# EAGLE board ELOB_V1722_Index_B (EAGLE 6.5.0), part 1 of 2
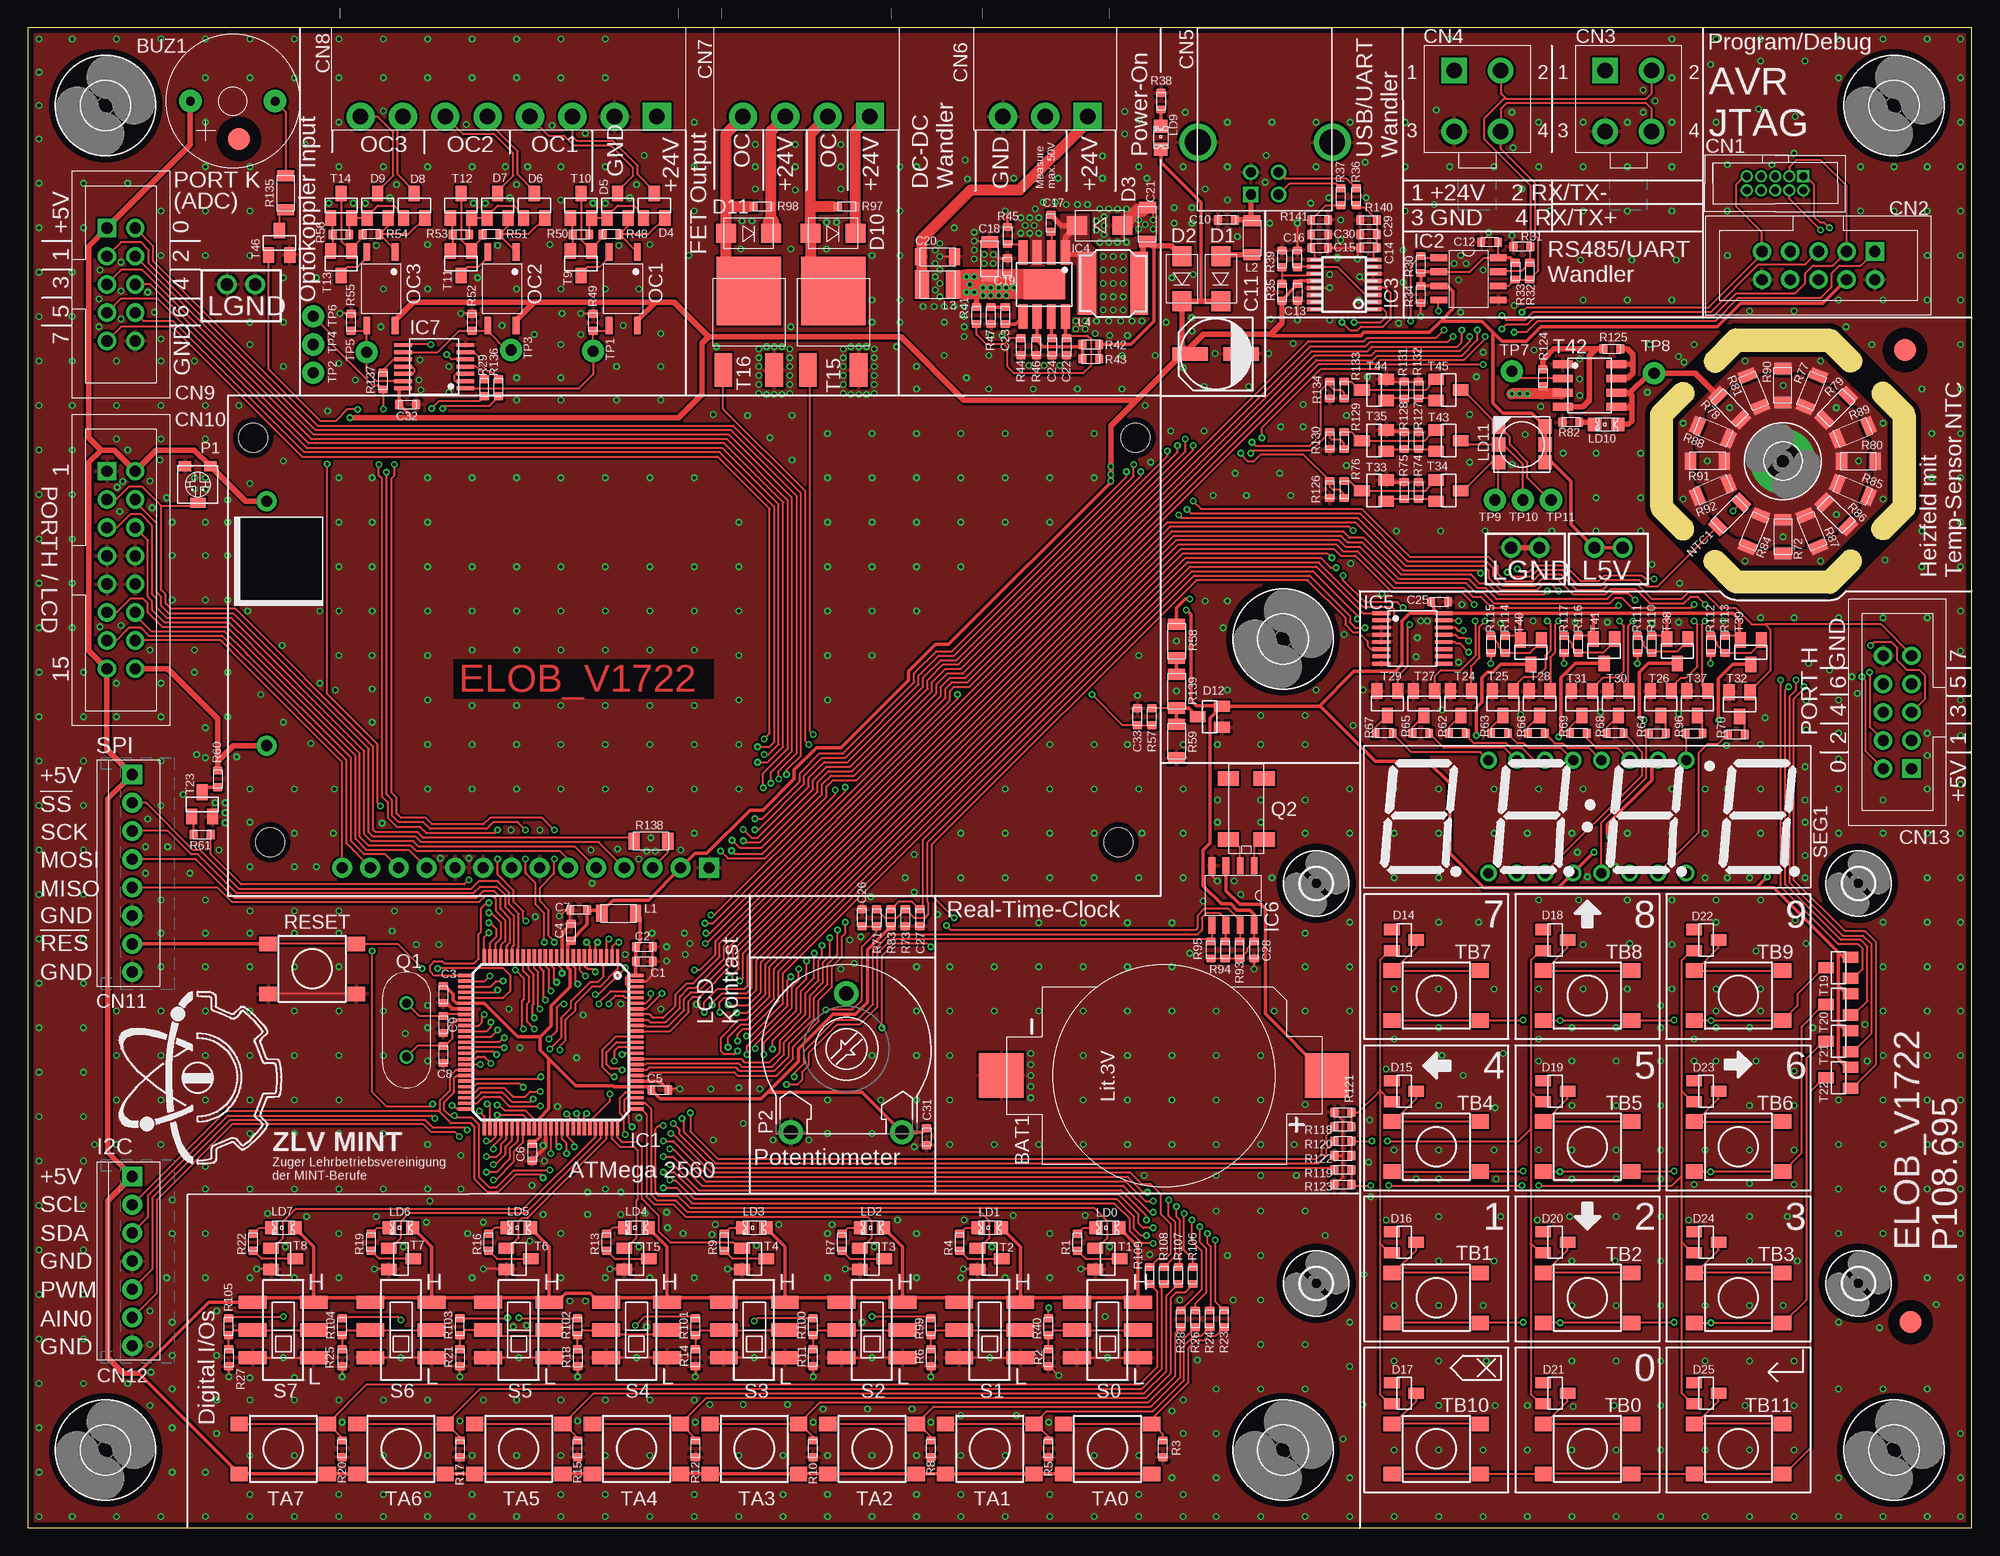
[diagram p8: board, top side]
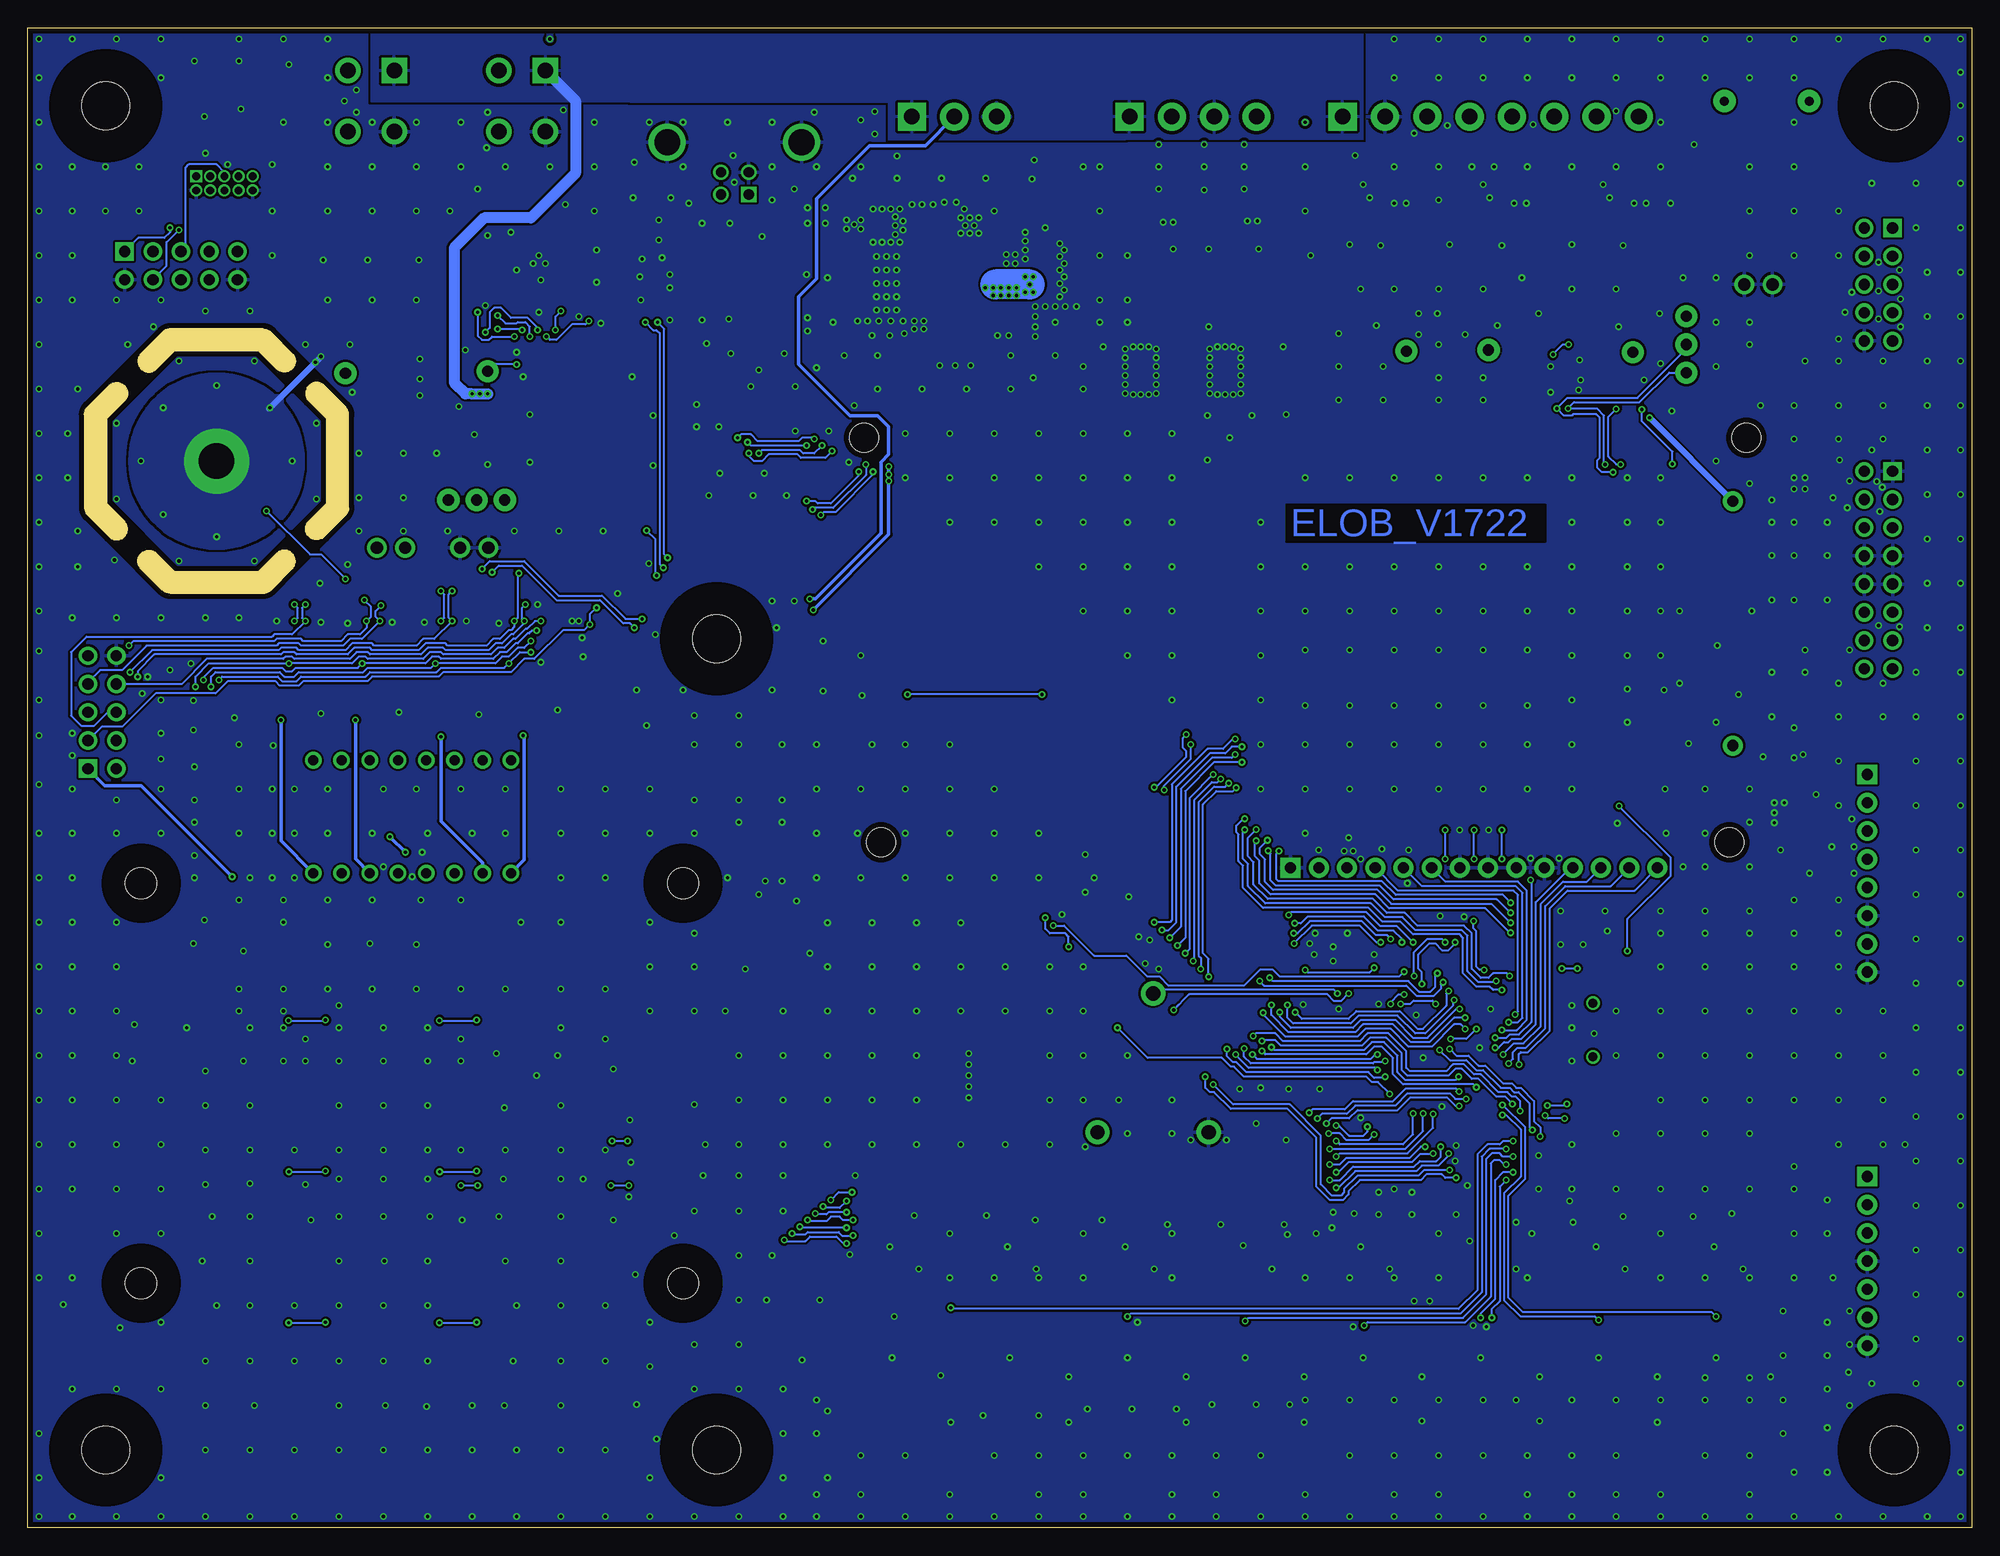
[diagram p9: board, bottom side, seen from below]

Size 175 x 135 mm. Coordinates in mm from the lower left corner, seen from the top.
Outline: 0,0 175,0 175,135 0,135 0,0
Outline: 162.19,84.1 arc45 162.89,84.39 164.82,86.32 arc45 165.1,87 arc45 164.82,87.68 164.78,87.72 arc45 164.1,88 arc45 163.42,87.72 161.8,86.1 154.2,86.1 152.58,87.72 arc45 151.9,88 arc45 151.22,87.72 151.18,87.68 arc45 150.9,87 arc45 151.18,86.32 153.11,84.39 arc45 153.81,84.1 162.19,84.1
Outline: 169.9,100.19 arc45 169.61,100.89 167.68,102.82 arc45 167,103.1 arc45 166.32,102.82 166.28,102.78 arc45 166,102.1 arc45 166.28,101.42 167.9,99.8 167.9,92.2 166.28,90.58 arc45 166,89.9 arc45 166.28,89.22 166.32,89.18 arc45 167,88.9 arc45 167.68,89.18 169.61,91.11 arc45 169.9,91.81 169.9,100.19
Outline: 146.1,91.81 arc45 146.39,91.11 148.32,89.18 arc45 149,88.9 arc45 149.68,89.18 149.72,89.22 arc45 150,89.9 arc45 149.72,90.58 148.1,92.2 148.1,99.8 149.72,101.42 arc45 150,102.1 arc45 149.72,102.78 149.68,102.82 arc45 149,103.1 arc45 148.32,102.82 146.39,100.89 arc45 146.1,100.19 146.1,91.81
Outline: 153.81,107.9 arc45 153.11,107.61 151.18,105.68 arc45 150.9,105 arc45 151.18,104.32 151.22,104.28 arc45 151.9,104 arc45 152.58,104.28 154.2,105.9 161.8,105.9 163.42,104.28 arc45 164.1,104 arc45 164.78,104.28 164.82,104.32 arc45 165.1,105 arc45 164.82,105.68 162.89,107.61 arc45 162.19,107.9 153.81,107.9
Copper layers (1*16): Top 0.035mm / dielectric 1.5mm / Bottom 0.035mm
Design rules "LED_0,20mm *": minimum track width 0.2mm, minimum drill 0.3mm, track to track 0.2mm, track to pad 0.2mm, pad to pad 0.2mm, via to via 0.2mm, smd to smd 0.2mm, copper to edge 0.5mm, drill to drill 0.2mm, minimum pad ring 0.15mm, minimum via ring 0.15mm, stop-mask expansion 4mil, vias tented up to drill 0.5mm, thermal gap 10mil
Net classes: 1 Power: clearance 0.5 mm; 3 PWM_OC: width 0.15 mm, drill 0.3 mm, clearance 0.8 mm to class 0, clearance 0.8 mm to class 1, clearance 0.2 mm to class 2, clearance 0.2 mm
tKeepout: 5 lines
tRestrict: 8 lines
bRestrict: 8 lines
Milling: 12 lines

## Footprints (pad centres in the part's own frame; a part is rotated, then mirrored left to right if it is on the bottom)
TESTPAD_2P_V1_NORESTRICT = drill 1.1 pad 1.778: 1 -1.27,0; 2 1.27,0
CR2032SMT_WÜRTH = smd 4 x 4: + 0,14.65; - 0,-14.65
BUZ_TCW12 = drill 0.8 pad 2.032: VCC 3.81,0; VSS -3.81,0
C0603 = smd 0.762 x 0.889: 1 -0.762,0; 2 0.762,0
ELKO_SMD_6.3 = smd 1.2 x 3.2: M 0,-2.3; P 0,2.3
C1206 = smd 1.016 x 1.524: 1 -1.524,0; 2 1.524,0
BH10G_1.27 = drill 0.7 pad 1.07 square: 1 -2.54,-0.635 | drill 0.7 pad 1.07: 2 -2.54,0.635; 3 -1.27,-0.635; 4 -1.27,0.635; 5 0,-0.635; 6 0,0.635; 7 1.27,-0.635; 8 1.27,0.635; 9 2.54,-0.635; 10 2.54,0.635
BH_10G = drill 1.016 pad 1.651 square: 1 -5.08,-1.27 | drill 1.016 pad 1.651: 2 -5.08,1.27; 3 -2.54,-1.27; 4 -2.54,1.27; 5 0,-1.27; 6 0,1.27; 7 2.54,-1.27; 8 2.54,1.27; 9 5.08,-1.27; 10 5.08,1.27
MOLEX_MINIFIT_4G = drill 1.4 pad 2.3 square: 1 2.1,-2.75 | drill 1.4 pad 2.3: 2 -2.1,-2.75; 3 2.1,2.75; 4 -2.1,2.75
USB-B = drill 0.92 square: 1 15,4.8 | drill 0.92: 2 15,7.3; 3 13,7.3; 4 13,4.8 | drill 2.33: 5 10.29,12.13; 6 10.29,0.03
PHOENIX_G381_3 = drill 1.4 pad 2.54 square: 1 -3.81,0 | drill 1.4 pad 2.54: 2 0,0; 3 3.81,0
PHOENIX_G381_4 = drill 1.4 pad 2.54 square: 1 -5.715,0 | drill 1.4 pad 2.54: 2 -1.905,0; 3 1.905,0; 4 5.715,0
PHOENIX_G381_8 = drill 1.4 pad 2.54 square: 1 -13.335,0 | drill 1.4 pad 2.54: 2 -9.525,0; 3 -5.715,0; 4 -1.905,0; 5 1.905,0; 6 5.715,0; 7 9.525,0; 8 13.335,0
BH_16G = drill 1.016 pad 1.651 square: 1 -8.89,-1.27 | drill 1.016 pad 1.651: 2 -8.89,1.27; 3 -6.35,-1.27; 4 -6.35,1.27; 5 -3.81,-1.27; 6 -3.81,1.27; 7 -1.27,-1.27; 8 -1.27,1.27; 9 1.27,-1.27; 10 1.27,1.27; 11 3.81,-1.27; 12 3.81,1.27; 13 6.35,-1.27; 14 6.35,1.27; 15 8.89,-1.27; 16 8.89,1.27
TYCO_MTA-100_8G = drill 1.016 pad 1.778 square: 1 8.89,0 | drill 1.016 pad 1.778: 2 6.35,0; 3 3.81,0; 4 1.27,0; 5 -1.27,0; 6 -3.81,0; 7 -6.35,0; 8 -8.89,0
TYCO_MTA-100_7G = drill 1.016 pad 1.778 square: 1 7.62,0 | drill 1.016 pad 1.778: 2 5.08,0; 3 2.54,0; 4 0,0; 5 -2.54,0; 6 -5.08,0; 7 -7.62,0
SMA = smd 1.8 x 1.7: A 2.03,0; C -2.03,0
SOT_23 = smd 1 x 1.4: 1 -0.95,-1.1; 2 0.95,-1.1; 3 0,1.1
DISPLAY_DMC16202NY-LY-AZE-BJN = drill 1 pad 1.8 square: 1 43.32,2.5 | drill 1 pad 1.8: 2 40.78,2.5; 3 38.24,2.5; 4 35.7,2.5; 5 33.16,2.5; 6 30.62,2.5; 7 28.08,2.5; 8 25.54,2.5; 9 23,2.5; 10 20.46,2.5; 11 17.92,2.5; 12 15.38,2.5; 13 12.84,2.5; 14 10.3,2.5; 15 3.5,13.5; 16 3.5,35.5 | hole 2.6: 3.8,4.8; 2.3,41.2; 81.7,41.2; 80.2,4.8
2,8 = hole 2.8: 0,0
4,3 = hole 4.3: 0,0
3,2-PAD = drill 3.2 pad 5.842: B3,2 0,0
TQFP100 = smd 0.3 x 1.2: 1 -6,-7.75; 2 -5.5,-7.75; 3 -5,-7.75; 4 -4.5,-7.75; 5 -4,-7.75; 6 -3.5,-7.75; 7 -3,-7.75; 8 -2.5,-7.75; 9 -2,-7.75; 10 -1.5,-7.75; 11 -1,-7.75; 12 -0.5,-7.75; 13 0,-7.75; 14 0.5,-7.75; 15 1,-7.75; 16 1.5,-7.75; 17 2,-7.75; 18 2.5,-7.75; 19 3,-7.75; 20 3.5,-7.75; 21 4,-7.75; 22 4.5,-7.75; 23 5,-7.75; 24 5.5,-7.75; 25 6,-7.75; 51 6,7.75; 52 5.5,7.75; 53 5,7.75; 54 4.5,7.75; 55 4,7.75; 56 3.5,7.75; 57 3,7.75; 58 2.5,7.75; 59 2,7.75; 60 1.5,7.75; 61 1,7.75; 62 0.5,7.75; 63 0,7.75; 64 -0.5,7.75; 65 -1,7.75; 66 -1.5,7.75; 67 -2,7.75; 68 -2.5,7.75; 69 -3,7.75; 70 -3.5,7.75; 71 -4,7.75; 72 -4.5,7.75; 73 -5,7.75; 74 -5.5,7.75; 75 -6,7.75 | smd 1.2 x 0.3: 26 7.75,-6; 27 7.75,-5.5; 28 7.75,-5; 29 7.75,-4.5; 30 7.75,-4; 31 7.75,-3.5; 32 7.75,-3; 33 7.75,-2.5; 34 7.75,-2; 35 7.75,-1.5; 36 7.75,-1; 37 7.75,-0.5; 38 7.75,0; 39 7.75,0.5; 40 7.75,1; 41 7.75,1.5; 42 7.75,2; 43 7.75,2.5; 44 7.75,3; 45 7.75,3.5; 46 7.75,4; 47 7.75,4.5; 48 7.75,5; 49 7.75,5.5; 50 7.75,6; 76 -7.75,6; 77 -7.75,5.5; 78 -7.75,5; 79 -7.75,4.5; 80 -7.75,4; 81 -7.75,3.5; 82 -7.75,3; 83 -7.75,2.5; 84 -7.75,2; 85 -7.75,1.5; 86 -7.75,1; 87 -7.75,0.5; 88 -7.75,0; 89 -7.75,-0.5; 90 -7.75,-1; 91 -7.75,-1.5; 92 -7.75,-2; 93 -7.75,-2.5; 94 -7.75,-3; 95 -7.75,-3.5; 96 -7.75,-4; 97 -7.75,-4.5; 98 -7.75,-5; 99 -7.75,-5.5; 100 -7.75,-6
SO_08 = smd 0.61 x 1.524: 1 -1.905,-2.667; 2 -0.635,-2.667; 3 0.635,-2.667; 4 1.905,-2.667; 5 1.905,2.667; 6 0.635,2.667; 7 -0.635,2.667; 8 -1.905,2.667
SSOP16 = smd 0.381 x 1.397: 1 -2.223,-2.654; 2 -1.587,-2.654; 3 -0.953,-2.654; 4 -0.318,-2.654; 5 0.318,-2.654; 6 0.953,-2.654; 7 1.587,-2.654; 8 2.223,-2.654; 9 2.223,2.654; 10 1.587,2.654; 11 0.953,2.654; 12 0.318,2.654; 13 -0.318,2.654; 14 -0.953,2.654; 15 -1.587,2.654; 16 -2.223,2.654
SO-8_EP_AOS = smd 0.8 x 2.2: 1 -1.905,-2.87; 2 -0.635,-2.87; 3 0.635,-2.87; 4 1.905,-2.87; 5 1.905,2.87; 6 0.635,2.87; 7 -0.635,2.87; 8 -1.905,2.87 | smd 3.7 x 2.71: T 0,0
TSSOP_16 = smd 0.35 x 1.6: 1 -2.275,-2.8; 2 -1.625,-2.8; 3 -0.975,-2.8; 4 -0.325,-2.8; 5 0.325,-2.8; 6 0.975,-2.8; 7 1.625,-2.8; 8 2.275,-2.8; 9 2.275,2.8; 10 1.625,2.8; 11 0.975,2.8; 12 0.325,2.8; 13 -0.325,2.8; 14 -0.975,2.8; 15 -1.625,2.8; 16 -2.275,2.8
TSSOP_14 = smd 0.35 x 1.6: 1 -1.95,-2.8; 2 -1.3,-2.8; 3 -0.65,-2.8; 4 0,-2.8; 5 0.65,-2.8; 6 1.3,-2.8; 7 1.95,-2.8; 8 1.95,2.8; 9 1.3,2.8; 10 0.65,2.8; 11 0,2.8; 12 -0.65,2.8; 13 -1.3,2.8; 14 -1.95,2.8
R1206 = smd 1.016 x 1.524: 1 -1.524,0; 2 1.524,0
L1210 = smd 1.27 x 2.54: 1 -1.397,0; 2 1.397,0
INDUCTOR_NR6028 = smd 5.7 x 1.6: 1 0,2.35; 2 0,-2.35
LED_0805 = smd 1.194 x 1.194: A 0,-1.041; K 0,1.041
LED_HARVATEK_HT-U3A8 = smd 1.3 x 1.2: 1 1.6,2.1; 2 0,2.1; 3 -1.6,2.1; 4 -1.6,-2.1; 5 0,-2.1; 6 1.6,-2.1
SOP_4 = smd 0.61 x 1.575: 1 -1.27,-3.302; 2 1.27,-3.302; 3 1.27,3.302; 4 -1.27,3.302
POTI_MURATA_PVG3A = smd 1.1 x 0.9: 1 1.15,-1.65; 3 -1.15,-1.65 | smd 1.4 x 0.9: 2 0,1.65
POTI_PIHER_PTC-15 = drill 1.3 pad 2.2: A -5,-7.5; E 5,-7.5; S 0,5
HC49_S = drill 0.813: 1 -2.413,0; 2 2.413,0
MC306 = smd 1.3 x 1.9: 1 -2.75,-1.6; 2 2.75,-1.6; 3 2.75,1.6; 4 -2.75,1.6
R0603 = smd 0.762 x 0.889: 1 -0.762,0; 2 0.762,0
PAS_PLACE = smd 2 x 2: DOT 0,0
DTSM-6 = smd 1.55 x 1.3: 1 -3.975,2.25; 2 3.975,2.25; 3 -3.975,-2.25; 4 3.975,-2.25
JS202011SCQN = smd 2.5 x 1.2: 1 -2.75,2.5; 2 -2.75,0; 3 -2.75,-2.5; 4 2.75,2.5; 5 2.75,0; 6 2.75,-2.5
4-FACH_7-SEGMENT = drill 0.9 pad 1.5: 1 -8.89,-5.08; 2 -6.35,-5.08; 3 -3.81,-5.08; 4 -1.27,-5.08; 5 1.27,-5.08; 6 3.81,-5.08; 7 6.35,-5.08; 8 8.89,-5.08; 9 8.89,5.08; 10 6.35,5.08; 11 3.81,5.08; 12 1.27,5.08; 13 -1.27,5.08; 14 -3.81,5.08; 15 -6.35,5.08; 16 -8.89,5.08
SOT23-BEC = smd 1 x 1.4: 1 -0.95,-1.1; 2 0.95,-1.1; 3 0,1.1
DPAK = smd 1.6 x 3: 1 -2.286,-5.207; 3 2.286,-5.207 | smd 5.8 x 6.2: 2 0,1.905
SOT23 = smd 1 x 1.4: 1 -0.95,-1.1; 2 0.95,-1.1; 3 0,1.1
SO-8_FET = smd 0.711 x 1.778: 1 -1.905,-2.413; 2 -0.635,-2.413; 3 0.635,-2.413; 4 1.905,-2.413; 5 1.905,2.413; 6 0.635,2.413; 7 -0.635,2.413; 8 -1.905,2.413
ANSCHLUSSPAD_1MM = drill 1 pad 2: 1 0,0

## Placement (x,y rotation side)
.L5V  L5V  [TESTPAD_2P_V1_NORESTRICT]  142.3,88.2 0 top
BAT1  CR2032  [CR2032SMT_WÜRTH]  102.3,40.7 270 top
BC  BC  [BARCODE]  22.6,87 0 top
BUZ1  OBO-1206C-A2  [BUZ_TCW12]  18.45,128.4 180 top
C1  1uF/16V  [C0603]  55.5,51 0 top
C2  100nF  [C0603]  55.5,52.3 0 top
C3  100nF  [C0603]  37.4,48 270 top
C4  100nF  [C0603]  48.9,53.6 90 top
C5  100nF  [C0603]  56.9,39.4 0 top
C6  100nF  [C0603]  45.4,33.8 270 top
C7  100nF  [C0603]  49.6,55.6 180 top
C8  22pF  [C0603]  37.4,42.6 270 top
C9  22pF  [C0603]  37.4,45.3 270 top
C10  10nF  [C0603]  107.9,117.7 180 top
C11  100uF/16V  [ELKO_SMD_6.3]  106.95,105.64 90 top
C12  100nF  [C0603]  131.6,115.7 180 top
C13  100nF  [C0603]  114.3,111.2 270 top
C14  22pF  [C0603]  120.7,115.2 180 top
C15  22pF  [C0603]  116.3,115.2 0 top
C16  100nF  [C0603]  114.3,114.2 90 top
C17  100nF  [C0603]  92.1,117.4 90 top
C18  10uF/35V  [C1206]  86.6,114.2 90 top
C19  100nF  [C0603]  88.2,113.5 90 top
C20  10uF/35V  [C1206]  81.9,114.4 0 top
C21  10uF/16V  [C1206]  100.8,117.3 90 top
C22  100nF  [C0603]  93.5,106.3 270 top
C23  1nF  [C0603]  88,109.1 90 top
C24  100nF  [C0603]  92.2,106.3 270 top
C25  100nF  [C0603]  127.1,83.35 0 top
C26  100nF  [C0603]  75.1,54.9 90 top
C27  100nF  [C0603]  80.3,54.9 270 top
C28  100nF  [C0603]  110.4,52 90 top
C29  22pF  [C0603]  120.7,116.4 180 top
C30  22pF  [C0603]  116.3,116.4 0 top
C31  100nF  [C0603]  80.9,35.2 270 top
C32  100nF  [C0603]  34.2,101.1 0 top
C33  100nF  [C0603]  99.9,73 90 top
CN1  BH10G_1.27  [BH10G_1.27]  157.3,121 180 top
CN2  WE_WR-BHD_10pol_gerade  [BH_10G]  161.2,113.6 180 top
CN3  Molex_MiniFit_4pol_gerade  [MOLEX_MINIFIT_4G]  144.1,128.4 180 top
CN4  Molex_MiniFit_4pol_gerade  [MOLEX_MINIFIT_4G]  130.5,128.4 180 top
CN5  USB_B_abgewinkelt  [USB-B]  105.3,135 270 top
CN6  WE_WR-TBL_3.81_3pol_abgew.  [PHOENIX_G381_3]  91.6,127 180 top
CN7  WE_WR-TBL_3.81_4pol_abgew.  [PHOENIX_G381_4]  70.1,127 180 top
CN8  WE_WR-TBL_3.81_8pol_abgew.  [PHOENIX_G381_8]  43.3,127 180 top
CN9  WE_WR-BHD_10pol_gerade  [BH_10G]  8.4,111.9 270 top
CN10  WE_WR-BHD_16pol_gerade  [BH_16G]  8.4,86.2 270 top
CN11  Tyco_MTA-100_8pol_gerade  [TYCO_MTA-100_8G]  9.4,58.9 90 top
CN12  Tyco_MTA-100_7pol_gerade  [TYCO_MTA-100_7G]  9.4,24 90 top
CN13  WE_WR-BHD_10pol_gerade  [BH_10G]  168.3,73.4 90 top
D1  B240  [SMA]  107.4,112.4 90 top
D2  B240  [SMA]  103.9,112.4 90 top
D3  B240  [SMA]  96.5,117.2 0 top
D4  BAV99  [SOT_23]  56.4,119 0 top
D5  BAV99  [SOT_23]  53.1,119 0 top
D6  BAV99  [SOT_23]  45.6,119 0 top
D7  BAV99  [SOT_23]  42.3,119 0 top
D8  BAV99  [SOT_23]  34.8,119 0 top
D9  BAV99  [SOT_23]  31.5,119 0 top
D10  B240  [SMA]  72.5,116.5 180 top
D11  B240  [SMA]  64.9,116.5 180 top
D12  BAV99  [SOT_23]  106.4,73 90 top
D14  BAV99  [SOT_23]  123.9,52.9 270 top
D15  BAV99  [SOT_23]  123.9,39.3 270 top
D16  BAV99  [SOT_23]  123.9,25.7 270 top
D17  BAV99  [SOT_23]  123.9,12.1 270 top
D18  BAV99  [SOT_23]  137.5,52.9 270 top
D19  BAV99  [SOT_23]  137.5,39.3 270 top
D20  BAV99  [SOT_23]  137.5,25.7 270 top
D21  BAV99  [SOT_23]  137.5,12.1 270 top
D22  BAV99  [SOT_23]  151.1,52.9 270 top
D23  BAV99  [SOT_23]  151.1,39.3 270 top
D24  BAV99  [SOT_23]  151.1,25.7 270 top
D25  BAV99  [SOT_23]  151.1,12.1 270 top
DI1  DMC16202NY  [DISPLAY_DMC16202NY-LY-AZE-BJN]  18,56.9 0 top
H1  np_MOUNT-HOLE2.8  [2,8]  116,22 0 top
H2  np_MOUNT-HOLE2.8  [2,8]  116,58 0 top
H3  np_MOUNT-HOLE2.8  [2,8]  164.8,22 0 top
H4  np_MOUNT-HOLE2.8  [2,8]  164.8,58 0 top
H5  np_MOUNT-HOLE4.3  [4,3]  168,128 0 top
H6  np_MOUNT-HOLE4.3  [4,3]  7,7 0 top
H7  np_MOUNT-HOLE4.3  [4,3]  113,7 0 top
H8  np_MOUNT-HOLE4.3  [4,3]  168,7 0 top
H9  np_MOUNT-HOLE4.3  [4,3]  7,128 0 top
H10  np_MOUNT-HOLE4.3  [4,3]  113,80 0 top
H11  np_MOUNT-PAD-ROUND3.2  [3,2-PAD]  158,96 90 top
IC1  ATMEGA2560-16  [TQFP100]  47.1,43.7 180 top
IC2  ST485B  [SO_08]  129.7,112.4 270 top
IC3  FT230X  [SSOP16]  118.5,111.9 90 top
IC4  AOZ1284  [SO-8_EP_AOS]  91.5,111.9 180 top
IC5  LVC138  [TSSOP_16]  124.65,80.05 270 top
IC6  DS1307  [SO_08]  108.5,56.9 180 top
IC7  HC14  [TSSOP_14]  36.6,104.5 90 top
L1  BEAD/1A/0,3R  [R1206]  53.2,55.3 0 top
L2  BEAD/1A/0,3R  [R1206]  110.2,116.1 270 top
L3  10uH/900mA  [L1210]  81.9,111.9 0 top
L4  10uH/1,9A  [INDUCTOR_NR6028]  97.7,112 90 top
LD0  GR  [LED_0805]  97.2,27 90 top
LD1  GR  [LED_0805]  86.6,27 90 top
LD2  GR  [LED_0805]  76,27 90 top
LD3  GR  [LED_0805]  65.4,27 90 top
LD4  GR  [LED_0805]  54.8,27 90 top
LD5  GR  [LED_0805]  44.2,27 90 top
LD6  GR  [LED_0805]  33.6,27 90 top
LD7  GR  [LED_0805]  23,27 90 top
LD9  GR  [LED_0805]  102,125.1 0 top
LD10  RE  [LED_0805]  142.1,99.3 90 top
LD11  RGB  [LED_HARVATEK_HT-U3A8]  134.5,97.5 270 top
NTC1  NTC_10k  [R1206]  153.2,91.2 45 top
OC1  PC357  [SOP_4]  53.6,111.5 180 top
OC2  PC357  [SOP_4]  42.7,111.5 180 top
OC3  PC357  [SOP_4]  31.8,111.5 180 top
P1  10k  [POTI_MURATA_PVG3A]  15.3,93.9 180 top
P2  10k  [POTI_PIHER_PTC-15]  73.7,43.1 0 top
Q1  16MHz  [HC49_S]  34.1,44.8 90 top
Q2  MC306  [MC306]  109.7,64.7 90 top
R1  1k2  [R0603]  94.5,25.7 90 top
R2  100k  [R0603]  91.9,15.3 90 top
R3  100k  [R0603]  102.2,7.1 90 top
R4  1k2  [R0603]  83.9,25.7 90 top
R5  100k  [R0603]  91.9,7.1 90 top
R6  100k  [R0603]  81.3,15.3 90 top
R7  1k2  [R0603]  73.3,25.7 90 top
R8  100k  [R0603]  81.3,7.1 90 top
R9  1k2  [R0603]  62.7,25.7 90 top
R10  100k  [R0603]  70.7,7.1 90 top
R11  100k  [R0603]  70.7,15.3 90 top
R12  100k  [R0603]  60.1,7.1 90 top
R13  1k2  [R0603]  52.1,25.7 90 top
R14  100k  [R0603]  60.1,15.3 90 top
R15  100k  [R0603]  49.5,7.1 90 top
R16  1k2  [R0603]  41.5,25.7 90 top
R17  100k  [R0603]  38.9,7.1 270 top
R18  100k  [R0603]  49.5,15.3 270 top
R19  1k2  [R0603]  30.9,25.7 90 top
R20  100k  [R0603]  28.3,7.1 90 top
R21  100k  [R0603]  38.9,15.3 270 top
R22  1k2  [R0603]  20.3,25.7 90 top
R23  1k0  [R0603]  107.7,18.8 90 top
R24  1k0  [R0603]  106.4,18.8 90 top
R25  100k  [R0603]  28.3,15.3 270 top
R26  1k0  [R0603]  105.1,18.8 90 top
R27  100k  [R0603]  18.1,15.3 270 top
R28  1k0  [R0603]  103.8,18.8 90 top
R29  1k0  [R0603]  41.1,102.6 90 top
R30  10k  [R0603]  125.4,113.7 90 top
R31  22k  [R0603]  134.5,115.3 180 top
R32  1k0  [R0603]  135.2,113.1 270 top
R33  22k  [R0603]  133.9,113.1 270 top
R34  10k  [R0603]  125.4,111 90 top
R35  10k  [R0603]  112.9,111.2 270 top
R36  27R  [R0603]  119.6,119.8 90 top
R37  27R  [R0603]  118.2,119.8 90 top
R38  1k2  [R0603]  102,128.4 270 top
R39  15k  [R0603]  112.9,114.2 270 top
R40  1k0  [R0603]  91.9,18.1 90 top
R41  68k  [R0603]  85.4,109.1 90 top
R42  56k  [R0603]  95.7,106.5 0 top
R43  1M  [R0603]  95.7,105.2 0 top
R44  10k  [R0603]  89.4,106.3 90 top
R45  47k  [R0603]  88.2,116.3 270 top
R46  10k  [R0603]  90.8,106.3 90 top
R47  39k  [R0603]  86.7,109.1 90 top
R48  10k  [R0603]  52.5,116.4 180 top
R49  270R  [R0603]  50.9,108.5 90 top
R50  82R  [R0603]  49.8,116.4 0 top
R51  10k  [R0603]  41.7,116.4 180 top
R52  270R  [R0603]  40,108.5 90 top
R53  82R  [R0603]  39,116.4 0 top
R54  10k  [R0603]  30.9,116.4 180 top
R55  270R  [R0603]  29.1,108.5 90 top
R56  82R  [R0603]  28.2,116.4 0 top
R57  100R  [R0603]  101.2,73 90 top
R58  470k  [R1206]  103.4,79.8 270 top
R59  56k  [R1206]  103.4,70.8 270 top
R60  12R  [R0603]  17.1,67.4 270 top
R61  10k  [R0603]  15.7,62.4 0 top
R62  150R  [R0603]  128.7,71.5 180 top
R63  150R  [R0603]  132.5,71.5 180 top
R64  150R  [R0603]  146.7,71.5 0 top
R65  150R  [R0603]  125.4,71.5 180 top
R66  470R  [R0603]  135.8,71.5 180 top
R67  150R  [R0603]  122.1,71.5 180 top
R68  150R  [R0603]  142.9,71.5 180 top
R69  150R  [R0603]  139.6,71.5 180 top
R70  150R  [R0603]  153.8,71.4 0 top
R71  2k7  [R0603]  76.4,54.9 270 top
R72  5k6  [R1206]  158,89.2 270 top
R73  10k  [R0603]  79,54.9 90 top
R74  22R  [R0603]  125.2,93.35 270 top
R75  180R  [R0603]  123.9,93.35 270 top
R76  22k  [R0603]  118.5,93.45 270 top
R77  5k6  [R1206]  160.6,102.3 67.5 top
R78  5k6  [R1206]  153.2,100.8 135 top
R79  5k6  [R1206]  162.8,100.8 45 top
R80  5k6  [R1206]  164.8,96 0 top
R81  5k6  [R1206]  155.4,102.3 112.5 top
R82  10k  [R0603]  138.9,99.5 180 top
R83  10R  [R0603]  77.7,54.9 90 top
R84  5k6  [R1206]  155.4,89.7 247.5 top
R85  5k6  [R1206]  164.3,93.4 337.5 top
R86  5k6  [R1206]  162.8,91.2 315 top
R87  5k6  [R1206]  160.6,89.7 292.5 top
R88  5k6  [R1206]  151.7,98.6 157.5 top
R89  5k6  [R1206]  164.3,98.6 22.5 top
R90  5k6  [R1206]  158,102.8 90 top
R91  5k6  [R1206]  151.2,96 180 top
R92  5k6  [R1206]  151.7,93.4 202.5 top
R93  10k  [R0603]  109.1,52 90 top
R94  10k  [R0603]  107.8,52 90 top
R95  10k  [R0603]  106.5,52 90 top
R96  470R  [R0603]  150,71.5 0 top
R97  100k  [R0603]  73.7,118.9 180 top
R98  100k  [R0603]  66.1,118.9 180 top
R99  1k0  [R0603]  81.3,18.1 90 top
R100  1k0  [R0603]  70.7,18.1 90 top
R101  1k0  [R0603]  60.1,18.1 90 top
R102  1k0  [R0603]  49.5,18.1 90 top
R103  1k0  [R0603]  38.9,18.1 90 top
R104  1k0  [R0603]  28.3,18.1 90 top
R105  1k0  [R0603]  18.1,18.1 90 top
R106  1k0  [R0603]  104.9,22.7 90 top
R107  1k0  [R0603]  103.6,22.7 90 top
R108  1k0  [R0603]  102.3,22.7 90 top
R109  1k0  [R0603]  101,22.7 90 top
R110  4k7  [R0603]  144.9,79.5 270 top
R111  100k  [R0603]  146.2,79.5 90 top
R112  4k7  [R0603]  151.5,79.5 270 top
R113  100k  [R0603]  152.8,79.5 90 top
R114  4k7  [R0603]  131.7,79.5 270 top
R115  100k  [R0603]  133,79.5 90 top
R116  4k7  [R0603]  138.3,79.5 270 top
R117  100k  [R0603]  139.6,79.5 90 top
R118  1k0  [R0603]  118.4,36.1 180 top
R119  1k0  [R0603]  118.4,32.2 180 top
R120  1k0  [R0603]  118.4,34.8 180 top
R121  100k  [R0603]  118.4,37.4 0 top
R122  100k  [R0603]  118.4,33.5 0 top
R123  100k  [R0603]  118.4,30.9 0 top
R124  6k8  [R0603]  136.4,103.5 270 top
R125  18k  [R0603]  142.6,106.1 0 top
R126  47k  [R0603]  117.2,93.45 270 top
R127  22R  [R0603]  125.2,97.85 270 top
R128  180R  [R0603]  123.9,97.85 270 top
R129  22k  [R0603]  118.5,97.85 270 top
R130  47k  [R0603]  117.2,97.85 270 top
R131  22R  [R0603]  123.9,102.4 270 top
R132  180R  [R0603]  125.2,102.4 270 top
R133  22k  [R0603]  118.5,102.4 270 top
R134  47k  [R0603]  117.2,102.4 270 top
R135  100R  [R1206]  23.2,120.15 270 top
R136  1k0  [R0603]  42.4,102.6 90 top
R137  1k0  [R0603]  32,103.2 90 top
R138  np_0R  [R1206]  56.1,61.8 180 top
R139  47k  [R1206]  103.4,75.3 270 top
R140  CG0603MLC-05LE  [R0603]  120.7,117.7 0 top
R141  CG0603MLC-05LE  [R0603]  116.3,117.7 180 top
REF1  DOT  [PAS_PLACE]  19,125 0 top
REF2  DOT  [PAS_PLACE]  169.5,18.5 0 top
REF3  DOT  [PAS_PLACE]  169,106 0 top
RESET  PTS645SM43  [DTSM-6]  25.6,50.3 180 top
S0  JS202011SCQN  [JS202011SCQN]  97.2,17.8 180 top
S1  JS202011SCQN  [JS202011SCQN]  86.6,17.8 180 top
S2  JS202011SCQN  [JS202011SCQN]  76,17.8 180 top
S3  JS202011SCQN  [JS202011SCQN]  65.4,17.8 180 top
S4  JS202011SCQN  [JS202011SCQN]  54.8,17.8 180 top
S5  JS202011SCQN  [JS202011SCQN]  44.2,17.8 180 top
S6  JS202011SCQN  [JS202011SCQN]  33.6,17.8 180 top
S7  JS202011SCQN  [JS202011SCQN]  23,17.8 180 top
SEG1  TDCG1050m  [4-FACH_7-SEGMENT]  140.4,64 0 top
T1  BCR116  [SOT_23]  97.2,24.2 270 top
T2  BCR116  [SOT_23]  86.6,24.2 270 top
T3  BCR116  [SOT_23]  76,24.2 270 top
T4  BCR116  [SOT_23]  65.4,24.2 270 top
T5  BCR116  [SOT_23]  54.8,24.2 270 top
T6  BCR116  [SOT_23]  44.2,24.2 270 top
T7  BCR116  [SOT_23]  33.6,24.2 270 top
T8  BCR116  [SOT_23]  23,24.2 270 top
T9  BC817-40  [SOT23-BEC]  49.8,113.8 180 top
T10  BC817-40  [SOT23-BEC]  49.8,119 0 top
T11  BC817-40  [SOT23-BEC]  39,113.8 180 top
T12  BC817-40  [SOT23-BEC]  39,119 0 top
T13  BC817-40  [SOT23-BEC]  28.2,113.8 180 top
T14  BC817-40  [SOT23-BEC]  28.2,119 0 top
T15  AOD4184A  [DPAK]  72.5,109.4 0 top
T16  AOD4184A  [DPAK]  64.9,109.4 0 top
T19  BCR166  [SOT_23]  163,50.4 90 top
T20  BCR166  [SOT_23]  163,47.1 90 top
T21  BCR166  [SOT_23]  163,43.8 90 top
T22  BCR166  [SOT_23]  163,40.5 90 top
T23  BC817-40  [SOT23-BEC]  15.7,65.1 0 top
T24  BCR116  [SOT_23]  129,74.2 180 top
T25  BCR116  [SOT_23]  132.8,74.2 180 top
T26  BCR116  [SOT_23]  147,74.2 180 top
T27  BCR116  [SOT_23]  125.7,74.2 180 top
T28  BCR116  [SOT_23]  136.1,74.2 180 top
T29  BCR116  [SOT_23]  122.4,74.2 180 top
T30  BCR116  [SOT_23]  143.2,74.2 180 top
T31  BCR116  [SOT_23]  139.9,74.2 180 top
T32  BCR116  [SOT_23]  154.1,74.1 180 top
T33  BC817-40  [SOT23-BEC]  121.2,93.35 90 top
T34  BC817-40  [SOT23-BEC]  127.9,93.35 270 top
T35  BC817-40  [SOT23-BEC]  121.2,97.85 90 top
T37  BCR116  [SOT_23]  150.3,74.2 180 top
T38  BC807-40  [SOT23]  148.5,78.9 180 top
T39  BC807-40  [SOT23]  155.1,78.8 180 top
T40  BC807-40  [SOT23]  135.3,78.8 180 top
T41  BC807-40  [SOT23]  141.9,78.9 180 top
T42  IRF7343  [SO-8_FET]  140.6,102.8 270 top
T43  BC817-40  [SOT23-BEC]  127.9,97.85 270 top
T44  BC817-40  [SOT23-BEC]  121.2,102.4 90 top
T45  BC817-40  [SOT23-BEC]  127.9,102.4 270 top
T46  BCR116  [SOT_23]  22.65,115.65 0 top
TA0  PTS645SM43  [DTSM-6]  97.2,7.1 180 top
TA1  PTS645SM43  [DTSM-6]  86.6,7.1 180 top
TA2  PTS645SM43  [DTSM-6]  76,7.1 180 top
TA3  PTS645SM43  [DTSM-6]  65.4,7.1 180 top
TA4  PTS645SM43  [DTSM-6]  54.8,7.1 180 top
TA5  PTS645SM43  [DTSM-6]  44.2,7.1 180 top
TA6  PTS645SM43  [DTSM-6]  33.6,7.1 180 top
TA7  PTS645SM43  [DTSM-6]  23,7.1 180 top
TB0  PTS645SM43  [DTSM-6]  140.4,7.1 0 top
TB1  PTS645SM43  [DTSM-6]  126.8,20.7 0 top
TB2  PTS645SM43  [DTSM-6]  140.4,20.7 0 top
TB3  PTS645SM43  [DTSM-6]  154,20.7 0 top
TB4  PTS645SM43  [DTSM-6]  126.8,34.3 0 top
TB5  PTS645SM43  [DTSM-6]  140.4,34.3 0 top
TB6  PTS645SM43  [DTSM-6]  154,34.3 0 top
TB7  PTS645SM43  [DTSM-6]  126.8,47.9 0 top
TB8  PTS645SM43  [DTSM-6]  140.4,47.9 0 top
TB9  PTS645SM43  [DTSM-6]  154,47.9 0 top
TB10  PTS645SM43  [DTSM-6]  126.8,7.1 0 top
TB11  PTS645SM43  [DTSM-6]  154,7.1 0 top
TP1  LGND  [TESTPAD_2P_V1_NORESTRICT]  134.8,88.2 0 top
TP2  TP8  [ANSCHLUSSPAD_1MM]  146.4,103.9 0 top
TP3  TP10  [ANSCHLUSSPAD_1MM]  134.6,92.5 0 top
TP4  TP2  [ANSCHLUSSPAD_1MM]  25.7,103.96 0 top
TP5  TP9  [ANSCHLUSSPAD_1MM]  132.06,92.5 0 top
TP6  TP11  [ANSCHLUSSPAD_1MM]  137.14,92.5 0 top
TP7  TP4  [ANSCHLUSSPAD_1MM]  25.7,106.5 0 top
TP8  TP6  [ANSCHLUSSPAD_1MM]  25.7,109.04 0 top
TP9  TP5  [ANSCHLUSSPAD_1MM]  30.5,105.8 0 top
TP10  TP3  [ANSCHLUSSPAD_1MM]  43.5,106 0 top
TP11  TP1  [ANSCHLUSSPAD_1MM]  50.9,105.9 0 top
TP12  LGND  [TESTPAD_2P_V1_NORESTRICT]  19.2,111.9 0 top
TP13  TP7  [ANSCHLUSSPAD_1MM]  133.6,104.1 0 top

## Tracks (layer width: path | path; a pad name or v marks a point on that pad's centre or on a via)
5V_NTC  (via drill 0.3)
  Top 0.2: NTC1.2 v153.5,91.5 | R83.2 78.44,56.4 79.56,56.4 C27.1 80.6,55.66 80.6,61.9 104.8,86.1 115.7,86.1 119.7,82.1 v119.7,81.8 | v146.4,85.4 145.6,85.4 145.3,85.7 141.9,85.7 141.4,85.2 139.8,85.2 138.4,86.6 135.7,86.6 135.1,86 134.4,86 v134.1,86.3
  Bottom 0.2: v153.5,91.5 149.6,87.6 148.6,87.6 v146.4,85.4 | v134.1,86.3 133.4,87 130.3,87 127.2,83.9 123.3,83.9 121.2,81.8 v119.7,81.8
!RESET!  (via drill 0.3)
  Top 0.2: IC1.30 42.8,47.7 43.45,48.35 43.45,49.7 42.8,50.35 v36.9,50.35 | RESET.4 RESET.3 33.3,52.55 v35.5,50.35
  Top 0.3: CN11.7 RESET.4
  Bottom 0.2: v36.9,50.35 v35.5,50.35
A
  Top 0.2: 136.42,69.08 SEG1.14 135.62,69.08 134.5,70.2 133.5,70.2 133.1,70.6 130.2,70.6 129.46,71.34 R62.1
AIN0  (via drill 0.3)
  Top 0.2: IC1.4 51.6,50.7 51.8,50.5 51.8,49.6 51.3,49.1 50.6,49.1 48.9,47.4 48.9,46.8 48,45.9 48,44.1 v47,43.1 | v38.85,35.2 38.45,35.6 36.3,35.6 35.6,36.3 18.4,36.3 11.6,29.5 11.6,21.12 CN12.6
  Bottom 0.2: v47,43.1 46.4,42.5 45.3,42.5 44.4,41.6 43.8,41.6 42.2,40 41.4,40 41,39.6 40.6,39.6 39.4,38.4 39.4,36.6 38.85,36.05 v38.85,35.2
B
  Top 0.2: SEG1.16 130.79,69.8 124.56,69.8 R67.1
BUZZER  (via drill 0.3)
  Top 0.2: v31.75,64.95 31.5,65.2 31.5,70.5 26.95,75.05 v26.95,95.75 | v29.7,100.65 28.75,100.65 27.7,99.6 26.35,99.6 21.7,104.25 T46.1 | v38.2,38 38.35,38 38.65,37.7 IC1.50 | v36.45,38.15 36.2,37.9 32.3,37.9 31,39.2 v31,51.9
  Bottom 0.2: v31.75,64.95 27.1,60.3 27.1,58.7 31,54.8 v31,51.9 | v26.95,95.75 26.95,96.85 29.7,99.6 v29.7,100.65 | v36.45,38.15 36.6,38 v38.2,38
C
  Top 0.2: SEG1.13 138.01,70.2 135.1,70.2 134.7,70.6 134.1,70.6 133.26,71.44 R63.1
D
  Top 0.2: SEG1.3 136.59,58.99 145.3,67.7 145.3,69.86 R68.1
DP
  Top 0.2: R70.1 152.14,70.5 151.2,70.5 150.4,69.7 150.4,62.57 SEG1.7
E
  Top 0.2: SEG1.5 141.67,63.47 145.7,67.5 145.7,71.26 R64.1
F
  Top 0.2: R69.1 140.36,71.04 141.2,70.2 143.09,70.2 SEG1.11
FET1  (via drill 0.3)
  Top 0.2: IC1.5 51.1,52.5 v51.3,52.7 | v60.95,54.4 61.7,54.4 73.6,66.3 v73.6,66.65 | v70.7,71.4 70.4,71.7 70.4,104.01 T15.1
  Bottom 0.2: v51.3,52.7 51.3,53 52.05,53.75 53.45,53.75 54.7,55 59.8,55 60.4,54.4 v60.95,54.4 | v73.6,66.65 73.45,66.65 70.7,69.4 70.7,69.9 71,70.2 71,71.1 v70.7,71.4
FET2  (via drill 0.3)
  Top 0.2: IC1.6 50.6,52.4 v50.3,52.7 | v61.5,55.15 61.85,55.15 72.7,66 v72.7,66.4 | v70.3,70.5 70,70.8 70,93.3 62.61,100.69 T16.1
  Bottom 0.2: v50.3,52.7 51.75,54.15 53.25,54.15 54.5,55.4 61.25,55.4 v61.5,55.15 | v72.7,66.4 72.7,66.8 70.3,69.2 v70.3,70.5
G
  Top 0.2: SEG1.15 132.93,70.2 127.46,70.2 R65.1
HEAT  (via drill 0.3)
  Top 0.2: IC1.23 42.1,52.55 42.6,53.05 42.6,54.45 41.7,55.35 v41.5,55.35 | v63.35,60.93 63.61,60.67 66.17,60.67 71.5,66.01 71.5,66.9 72.3,67.7 74.4,67.7 81.8,75.1 81.8,75.9 82.8,76.9 84.2,76.9 104.2,96.9 v104.2,98 | v111.1,98.1 111.1,99 116.4,104.3 121.5,104.3 121.9,104.7 v131,104.7 | T42.2 138.12,103.5 134.2,103.5 TP13.1
  Bottom 0.2: v41.5,55.35 41.55,55.35 42.75,56.55 52.05,56.55 53.3,57.8 62.66,57.8 63.12,58.26 63.12,60.7 v63.35,60.93 | v104.2,98 104.3,98.1 105.3,98.1 105.6,97.8 109.3,97.8 109.9,98.4 110.8,98.4 v111.1,98.1 | v131,104.7 133,104.7 TP13.1
I2C_SCL  (via drill 0.3)
  Top 0.2: R94.2 107.8,54.17 IC6.6 107.86,54.73 107.3,55.3 106.1,55.3 105.7,54.9 105.7,53.8 105.3,53.4 77.6,53.4 76.1,51.9 76.1,47.1 74.7,45.7 72.7,45.7 69.9,42.9 69.9,41.8 69,40.9 v69,40.6 | IC1.43 38.5,41.2 38,40.7 38,39.4 37.1,38.5 37.1,37.7 | v46.4,31.5 46.1,31.8 43.95,31.8 42.4,30.25 41.35,30.25 40.2,31.4 40.2,36.1 39.9,36.4 38.1,36.4 37.1,37.4 | 37.1,37.4 37.1,37.7 | 37.1,37.7 36.9,37.5 | 37.1,37.4 37,37.5 36.9,37.5 | 36.9,37.5 17.82,37.5 CN12.2
  Bottom 0.2: v46.4,31.5 47.4,31.5 47.7,31.8 49.1,31.8 49.6,31.3 55.1,31.3 56.1,30.3 56.1,30 56.6,29.5 57.8,29.5 59,30.7 59,35.1 61.6,37.7 66.7,37.7 68.2,39.2 68.6,39.2 69,39.6 v69,40.6
I2C_SDA  (via drill 0.3)
  Top 0.2: 106.59,54.7 IC6.5 106.59,52.86 R95.2 106.26,53 77.8,53 76.5,51.7 76.5,46.9 74.9,45.3 72.9,45.3 70.3,42.7 70.3,41.6 69.7,41 69.7,40.3 69.3,39.9 v68.3,39.9 | v47,32.2 43.75,32.2 42.2,30.65 41.55,30.65 40.6,31.6 40.6,36.3 40,36.9 38.6,36.9 v38.4,37.1 38,37.1 37.5,37.6 37.5,38.3 38.4,39.2 38.4,40.5 38.6,40.7 IC1.44 | v36.65,36.85 36.4,37.1 18,37.1 10.8,29.9 10.8,27.94 CN12.3
  Bottom 0.2: v47,32.2 49.3,32.2 49.8,31.7 55.3,31.7 56.5,30.5 56.5,30.2 56.8,29.9 57.6,29.9 58.6,30.9 58.6,35.3 61.4,38.1 66.5,38.1 v68.3,39.9 | v36.65,36.85 38.15,36.85 v38.4,37.1
JTAG_TCK  (via drill 0.3)
  Top 0.2: v133.8,107.6 134.9,107.6 135.9,108.6 151.9,108.6 154,110.7 161.4,110.7 162.4,111.7 162.4,112.9 163.1,113.6 165.01,113.6 CN2.1 | IC1.93 56,46.2 56.3,45.9 57.2,45.9 58.3,47 58.3,48 59.3,49 59.9,49 62.3,51.4 62.3,52.6 115.6,105.9 120.6,105.9 121,106.3 128.7,106.3 129.1,106.7 v129.1,107.8 | v162.2,117 161.7,117.5 161.3,117.5 160.8,118 160.8,120.9 160.06,121.64 CN1.1
  Bottom 0.2: v129.1,107.8 129.1,108 130,108.9 131.5,108.9 132.4,109.8 133,109.8 133.4,109.4 133.4,108 v133.8,107.6 | v162.2,117 162.2,116.6 162.7,116.1 165.05,116.1 CN2.1
JTAG_TDI  (via drill 0.3)
  Top 0.2: v134.5,109.4 134.9,109.8 151.3,109.8 156.12,114.62 CN2.9 156.12,116.58 153.8,118.9 153.8,120.9 154.53,121.64 CN1.9 | IC1.90 57.8,44.7 59.5,46.4 59.5,47.4 59.9,47.8 60.5,47.8 63.5,50.8 63.5,52 116.2,104.7 121.3,104.7 121.7,105.1 129.3,105.1 131.2,107 v131.2,107.2
  Bottom 0.2: v134.5,109.4 134.5,107.3 134.1,106.9 133.5,106.9 133.2,107.2 v131.2,107.2
JTAG_TDO  (via drill 0.3)
  Top 0.2: v132.7,107.9 133.1,108.3 135,108.3 135.7,109 151.7,109 153.8,111.1 159.1,111.1 160,112 160,112.9 160.7,113.6 162.47,113.6 CN2.3 163.74,120.76 161.4,123.1 159.2,123.1 158.57,122.47 CN1.3 | IC1.91 55.6,45.2 55.7,45.1 57.6,45.1 59.1,46.6 59.1,47.6 59.7,48.2 60.3,48.2 63.1,51 63.1,52.2 116,105.1 121.1,105.1 121.5,105.5 129.1,105.5 130.5,106.9 v130.5,107.8
  Bottom 0.2: v132.7,107.9 130.6,107.9 v130.5,107.8
JTAG_TMS  (via drill 0.3)
  Top 0.2: v132.7,109.1 133.1,108.7 134.8,108.7 135.5,109.4 151.5,109.4 155.8,113.7 160.03,113.7 CN2.5 | IC1.92 55.8,45.7 56,45.5 57.4,45.5 58.7,46.8 58.7,47.8 59.5,48.6 60.1,48.6 62.7,51.2 62.7,52.4 115.8,105.5 120.9,105.5 121.3,105.9 128.9,105.9 129.8,106.8 v129.8,107.2
  Bottom 0.2: v129.8,107.2 129.8,108.1 130.2,108.5 130.9,108.5 131,108.4 132,108.4 v132.7,109.1 | CN2.5 160.8,115.27 160.8,122.4 160.5,122.7 158,122.7 157.3,122 CN1.5
L5V  (via drill 0.3)
  Top 0.2: R95.1 R94.1 R93.1 109.14,51.24 109.8,51.9 109.8,52.16 C28.2 IC6.8 | 132.4,114.34 132.4,115.66 C12.1 | IC2.2 129.84,113.03 131.1,114.3 IC2.8 | T39.2 153.79,80.26 R113.2 | T41.2 140.69,80.26 R117.2 | T38.2 147.29,80.26 R111.2 | T40.2 133.99,80.26 R115.2 | v161.4,116.8 158.57,119.63 CN1.4
  Top 0.3: TA0.1 TA0.2 TA1.1 TA1.2 TA2.1 TA2.2 TA3.1 TA3.2 TA4.1 TA4.2 TA5.1 TA5.2 TA6.1 TA6.2 TA7.1 TA7.2 9.97,13.9 9.3,13.9 | IC3.12 114.56,112.22 C13.1 114.3,111.9 112.9,110.5 R35.2 | 56.14,39.26 C5.1 | C5.1 55.84,39.7 IC1.80 52.8,39.7 52.7,39.8 49.3,39.8 46.9,42.2 | C6.1 45.46,34.56 46.1,35.2 IC1.61 46.1,36.9 46.9,37.7 46.9,42.2 | C3.1 37.54,48.76 38.3,48 38.3,47.5 38.6,47.2 IC1.31 41.1,47.2 44.1,44.2 46.1,44.2 | LD7.A 25.75,25.29 S7.3 | LD0.A 99.95,25.29 S0.3 99.55,20.7 94.85,20.7 S0.6 94.05,20.7 89.75,20.7 S1.3 | IC2.2 125.5,113.03 R30.1 125.36,112.9 125.4,112.86 R34.2 IC2.3 127.07,111.8 127.8,111.8 128.3,111.3 128.3,109.7 127.2,108.6 | 131.9,114.31 IC2.8 | IC2.8 132.4,114.34 | IC2.8 133.46,114.31 R33.1 | L1.1 51.38,55.6 C7.1 50.36,54.3 C4.1 48.6,52.54 IC1.10 48.6,50.4 48.8,50.2 48.8,48.7 47.1,47 47.1,45.2 46.1,44.2 | L1.1 51.68,55.58 | IC6.8 110.41,55.2 110,55.6 108.85,55.6 108.3,56.15 107.45,56.15 105.8,57.8 105.8,61 106.4,61.6 106.4,72.85 D12.2 | L1.1 51.68,55.48 52.7,56.5 55.88,56.5 DI1.2 60.08,60.7 61.1,60.7 65,64.6 66.2,64.6 69,67.4 69,68.2 71,70.2 73.2,70.2 79.3,76.3 79.3,77.1 81.7,79.5 82.9,79.5 97.5,94.1 | 66.6,39.2 69.4,42 69.4,43.1 72.5,46.2 74.5,46.2 75.6,47.3 75.6,52.04 R83.1 | S6.3 36.35,25.29 LD6.A | S5.3 46.95,25.29 LD5.A | S4.3 57.55,25.29 LD4.A | S3.3 68.15,25.29 LD3.A | S2.3 78.75,25.29 LD2.A | S1.3 89.35,25.29 LD1.A | S7.3 25.35,20.7 20.65,20.7 S7.6 16.3,20.3 9.9,13.9 | S7.3 26.15,20.7 30.45,20.7 S6.6 31.25,20.7 35.95,20.7 S6.3 | S6.3 36.75,20.7 41.05,20.7 S5.6 41.85,20.7 46.55,20.7 S5.3 | S5.3 47.35,20.7 48,20.7 48.4,21.1 50.6,21.1 51.4,20.3 S4.6
  Top 0.3: 51.65,20.7 S4.6 | S4.6 52.45,20.7 57.15,20.7 S4.3 | S4.3 57.95,20.7 62.25,20.7 S3.6 63.05,20.7 67.75,20.7 S3.3 | S3.3 68.55,20.7 72.85,20.7 S2.6 73.65,20.7 78.35,20.7 S2.3 | S2.3 79.15,20.7 83.45,20.7 S1.6 84.25,20.7 88.95,20.7 S1.3 | 163,45.4 163,42.2 163.75,41.45 T22.2 | 163,45.4 163,48.8 | 163,48.8 163,51.8 | 163,51.8 157.2,57.6 155.6,57.6 | T21.2 163.65,44.75 163,45.4 | T20.2 163.75,48.05 163,48.8 | LD9.A 102,122.9 105.6,119.3 105.6,110.37 | 34.64,99.9 C32.1 33.44,102.55 IC7.14 | 46.9,42.2 46.1,43 46.1,44.2 | 134.3,82.3 134.3,80.57 133.99,80.26 | 134.3,82.3 140.95,82.3 | 140.95,82.3 147.55,82.3 | 147.55,82.3 153.5,82.3 154.1,81.7 154.1,80.57 153.79,80.26 | 140.95,82.3 T41.2 | 147.55,82.3 T38.2 | v141,60.8 SEG1.4 | SEG1.4 | v142.4,62.2 142.2,62.4 142.2,63.3 146.2,67.3 146.2,68.53 SEG1.10 | 126.6,82.33 IC5.16 134.28,82.33 134.3,82.3 | 126.6,82.33 124.42,82.33 123.7,81.6 123.7,77.7 123.1,77.1 119.4,77.1 116.3,74 116.35,73.95 | SEG1.4 137.8,57.6 | 137.8,57.6 131.1,57.6 128,60.7 128,67 126,69 121.3,69 116.35,73.95 | 111.9,107.4 112,107.3 120,107.3 120.3,107.6 126.2,107.6 127.2,108.6 | 131.9,107.6 132.7,106.8 134.9,106.8 136.2,108.1 152.1,108.1 154.2,110.2 161.6,110.2 CN2.4 | 131.9,107.6 130.9,108.6 127.2,108.6 | LD11.1 136.6,96.1 | 136.6,96.1 LD11.2 LD11.3 135.4,100.3 132.8,100.3 131.9,101.2 131.9,107.6 | C25.1 126.6,83.09 126.6,82.33 | C5.1 56.94,38.6 66,38.6 66.6,39.2 | 66.6,39.2 75.1,39.2 P2.E 80.54,35.6 C31.1 | T19.2 163.45,51.35 163,51.8 | 137.8,57.6 155.6,57.6 | 155.6,57.6 v156.6,58.6 | 136.6,96.1 137,96.1 138.9,94.2 138.9,90.33 .L5V.1 .L5V.2 | v104.3,82.6 104.7,82.2 104.7,74.5 105.2,74 107.45,74 D12.2
  Top 0.3: D12.2 116.35,73.95
  Top 0.5: 33.07,107.73 OC3.4 33.07,108.67 34.7,110.3 45.6,110.3 | 43.97,107.73 OC2.4 43.97,108.67 45.6,110.3 | 54.87,107.83 OC1.4 54.87,108.67 56.5,110.3 | 6.6,97 5.5,95.9 5.5,78.94 CN10.15 7.13,70.06 CN11.1 7.2,65.59 7.2,33.82 CN12.1 7.2,29.42 7.2,15.3 8.6,13.9 9.3,13.9 9.9,13.9 | 61.3,107.2 60.7,106.6 60.7,102 58.6,99.9 34.64,99.9 v29,99.9 | 61.3,107.2 78.6,107.2 84.3,101.5 99.8,101.5 | D1.C 105.6,110.37 D2.C 103.9,106.39 C11.P 104.1,105.64 | 61.3,107.2 58.2,110.3 56.5,110.3 | 56.5,110.3 45.6,110.3 | BUZ1.VCC 14.64,124.49 CN9.1 5.5,115.35 5.5,98.1 6.6,97 | 99.8,101.5 97.5,99.2 v97.5,95.5 v97.5,94.8 v97.5,94.2 97.5,94.1 | 99.8,101.5 103.94,105.64 104.1,105.64 | 104.1,105.64 105.86,107.4 111.9,107.4 112.9,108.4 R35.2 | DI1.16 19.6,92.4 P1.3 15,97 11.58,97 CN10.2 7.76,97 6.6,97
  Bottom 0.2: CN2.4 162.5,113.57 162.5,115.7 v161.4,116.8
  Bottom 0.3: v141,60.8 v142.4,62.2 | v97.5,95.5 v97.5,94.8 v97.5,94.2 97.5,89.4 v104.3,82.6 | v156.6,58.6 164.8,66.8 168.05,66.8 CN13.1
  Bottom 0.5: v29,99.9 DI1.16
L24V  (via drill 0.3)
  Top 0.5: R98.1 66.89,118.87 66.89,117.5 | R97.1 74.53,118.83 74.53,117 | T42.3 138.08,102.06 | 136.34,102.06 136.4,102.06 R124.2
  Top 1: 76.03,127.21 CN7.1 74.53,125.72 74.53,117 D10.C 74.52,116.52 | D11.C 66.89,116.53 | L3.1 80.5,114.4 | 80.5,114.4 C20.1 | 66.89,117.5 66.89,125.7 CN7.3 | 80.5,114.4 80.5,116 84.9,120.4 89.3,120.4 95.41,126.51 CN6.1 | 138.08,102.06 136.34,102.06 v133.6,102.06
  Top 1.5: 66.89,116.53 66.89,117.5
  Bottom 1: CN4.1 125.7,128.45 125.7,121.9 129.7,117.9 133.9,117.9 136.6,115.2 136.6,103.06 135.6,102.06 v135,102.06 v134.3,102.06 v133.6,102.06
  pour Bottom (isolate 0.3): 54.8,125 54.8,135 144.1,135 144.1,128.4 97.5,128.3 97.5,124.9
LGND  (via drill 0.3)
  Top 0.2: 45.44,33.04 C6.2 | R55.2 29.06,109.3 v28.1,109.3 | R52.2 39.96,109.3 v39,109.3 | C20.2 v82.1,114.4 | C18.2 86.52,115.8 v85.2,115.8 | C21.2 101.3,118.32 v101.3,117.7 | 100.3,118.8 100.32,118.82 | R38.1 102.04,129.2 | v114.3,117.4 C16.2 | C13.2 v114.3,108.7 | IC3.13 115.86,111.6 v117.2,111.6 | C15.2 C14.2 119.7,114.96 v119.7,114.2 | IC3.5 120.28,112.22 v119.9,112.6 | v125.4,109 R34.1 | C12.2 131.5,116.36 v131.5,116.6 | 133.7,115.34 R31.2 133.6,115.44 v133.6,116.3 | S0.4 v97.2,15.3 S0.1 | R2.1 91.96,14.54 v92.8,13.7 | S1.1 v86.6,15.3 S1.4 | R6.1 v81.3,13.6 | S2.1 v76,15.3 S2.4 | R11.1 v70.7,13.6 | S3.1 v65.4,15.3 S3.4 | R14.1 v60.1,13.6 | S4.1 v54.8,15.3 S4.4 | R18.2 v49.5,13.6 | S5.1 v44.2,15.3 S5.4 | v38.9,13.6 R21.2 | S6.1 v33.6,15.3 S6.4 | R25.2 v28.3,13.6 | R27.2 v18.1,13.6 | S7.4 v23,15.3 S7.1 | T8.2 21.85,23.3 v20.6,23.3 | T7.2 32.45,23.3 v31.2,23.3 | T6.2 43.05,23.3 v41,23.3 | T5.2 53.65,23.3 v52.4,23.3 | T4.2 64.25,23.3 v63,23.3 | T3.2 74.85,23.3 v73.6,23.3 | T2.2 85.45,23.3 v84.2,23.3 | T1.2 96.05,23.3 v94.8,23.3 | C4.2 48.84,54.42 C7.2 | C7.2 48.9,55.66 | C2.2 C1.2 56.26,49.76 55.7,49.2 IC1.99 | C28.1 v110.4,50.3 | IC6.4 106.59,58.7 v107.1,58.2 | R45.1 88.2,118.3 v88,118.5 | C19.2 88.26,114.2 | 88.26,114.2 88.3,114.2 | 88.26,114.2 87.3,114.2 v86.9,114.6 | v49.8,109.3 50.86,109.3 R49.2 | R123.1 117.7,30.9 118.4,31.6 118.4,33.6 | 118.4,33.6 118.4,36.64 R121.1 | R122.1 118.3,33.5 118.4,33.6 | v47.85,55.05 48.4,55.6 C7.2 | v58.7,39.5 57.76,39.5 C5.2 | RESET.1 RESET.2 | T44.2 122.49,103.16 R131.1 R132.1 | R128.1 123.69,98.61 123.6,98.7
  Top 0.3: IC1.11 48.1,53.56 C4.2 | IC1.81 56.86,40.2 C5.2 57.8,39.4 | IC1.32 38.2,46.7 37.66,47.24 C3.2 | C6.2 45.4,33.1 46.6,34.3 IC1.62 | C26.2 75.1,55.6 75,55.5 | 123.6,98.7 122.4,98.7 T35.2 | R75.1 122.99,94.11 122.9,94.2 122.4,94.2 T33.2
  Top 0.5: TP1.2 TP1.1
  Top 1: 100.3,118.6 100.5,118.8 100.8,118.8
  Top 1.2: D3.A 99.93,118.6 100.3,118.6
  Bottom 0.5: 153.3,100.7 v153.2,100.8 v148.6,105.4
  other vias: 72,35.5 46.4,34.4 123.8,112.1 133.8,110 42.7,108.2 31.8,108.1 53.6,108.2 8.28,91.46 11.2,91.8 55,36.9 82.1,110.8 81.7,111.4 82.1,112 81.7,112.6 82.1,113.2 81.7,113.8 81.7,115 82.1,115.6 86.1,113.8 86.9,113.8 86.1,114.6 85.2,115 85.2,116.6 96.8,114.4 97.7,114.4 98.6,114.4 91,116.5 90.2,116.5 89.4,116.5 89.8,117.2 90.6,117.2 90.2,117.9 91,117.9 89.4,117.9 101.3,116.9 96.8,113.2 97.7,113.2 98.6,113.2 96.8,112 97.7,112 98.6,112 96.8,110.8 97.7,110.8 98.6,110.8 96.8,109.6 97.7,109.6 98.6,109.6 55.6,28.3 36.2,29.4 67.2,106.3 66.5,106.3 67.9,106.3 68.6,106.1 68.6,105.3 68.6,104.5 68.6,103.7 68.6,102.9 68.6,102.1 67.2,102 67.9,102 66.5,102 65.8,102.9 65.8,102.1 65.8,103.7 65.8,104.5 65.8,105.3 65.8,106.1 74.8,106.3 74.1,106.3 75.5,106.3 76.2,106.1 76.2,105.3 76.2,104.5 76.2,103.7 76.2,102.9 76.2,102.1 74.8,102 75.5,102 74.1,102 73.4,102.9 73.4,102.1 73.4,103.7 73.4,104.5 73.4,105.3 73.4,106.1 85.2,114.2 16.87,65.25 17.77,63.45 17.77,64.35 17.77,65.25 90.3,40.7 90.3,41.7 90.3,42.7 90.3,39.7 90.3,38.7 36,45 36,47 36,42 28,134 32,134 36,134 40,134 44,134 48,134 52,134 128,134 148,134 152,134 156,134 163,134 167,134 171,134 174,134 20,1 24,1 28,1 32,1 36,1 40,1 44,1 48,1 52,1 56,1 60,1 64,1 68,1 72,1 76,1 80,1 84,1 88,1 92,1 96,1 100,1 107,1 111,1 115,1 119,1 123,1 127,1 131,1 135,1 139,1 143,1 147,1 151,1 155,1 159,1 163,1 167,1 171,1 174,1 174,130.5 174,126.5 174,122.5 174,118.5 174,114.5 174,110.5 174,106.5 174,102.5 174,98.5 174,94.5 174,90.5 174,86.5 174,82.5 174,78.9 174,74.5 174,71.3 174,66.9 174,62.5 174,58.5 174,54.5 174,50.5 174,46.5 174,42.5 174,38.5 174,34.5 174,30.5 174,26.5 174,22.5 174,8.5 174,4.5 28,130.5 32,130.5 36,130.5 40,130.5 44,130.5 48,130.5 52,130.5 55.5,123.5 60,122.5 60,118.5 60,126.5 148,130.5 151.5,131.7 156,132 163,130.5 155.8,127.7 152,126.5 148,126.5 148,122.5 148.4,114.1 144.4,114.1 139.8,114.1 140,110.5 144,110.5 148,110.5 148,118.5 144,118.5 140,118.5 137,118.5 136,122.5 140,122.5 144,122.5 144,126.5 140,126.5 136,126.5 124,126.5 108,126.5 112,126.5 116,126.5 119.05,126.5 120.4,122.9 124,122.5 128,122.5 132,122.5 116,122.5 108,122.5 104,122.5 100,126.7 100,122.5 97.3,118.7 80,122.5 84.4,123.1 78.5,118.5 78.5,122.5 76,114.5 76,110.5 76,108.5 84.3,107.2 73.2,122.5 73.2,120.5 69.1,120.4 69.1,122.5 65.5,122.5 65.5,120.5 65.5,124.5 69.1,124.5 73.2,124.5 59.5,114.5 55,111.5 56,115.5 57,107.5 48,119.5 36,115.5 36,111.5 40.5,112.5 44,111.5 48,111.5 47,115.5 52,111.5 32,111.5 16,22.5 20,22.5 16,26.5 24,22.5 28,22.5 40,22.5 39.6,26.5 28,26.5 48,22.5 48,26.5 52,30.5 52,22.5 56,22.5 60,22.5 72,22.5 72,26.5 67.6,27.3 80,22.5 80,26.5 84,22.5 88,22.5 92,22.5 92,26.5 28,90.5 28,94.5 11,94.2 28,86.5 28,82.5 28,78.5 36,78.5 36,82.5 36,90.5 64,90.5 48,86.5 52,86.5 56,86.5 60,86.5 64,86.5 64,82.5 60,82.5 56,82.5 52,82.5 48,82.5 44,82.5 40,82.5 40,79 44,79 48,79 52,79 56,79 60,79 64,78.5 64,74.5 60,74 56,74 52,74 48,74 44,74 40,74 36,74.5 36,70.5 40,70.5 44,70.5 48,70.5 52,70.5 56,70.5 60,70.5 64,70.5 64,66.5 60,66.5 56,66.5 52,66.5 48,66.5 44,66.5 40,66.5 36,66.5 56.1,62.1 60,62.5 24,66.5 20,66.5 24,62.5 16,69.3 23,72.5 16,50.5 16,46.5 16,42.5 16,38.5 72,94.5 76,94.5 76,98.5 72,98.5 80,98.5 80,94.5 80,90.5 76,90.5 72,90.5 84,98.5 88,98.5 92,98.5 92,94.5 88,94.5 84,94.5 84,90.5 88,90.5 84,86.5 80,86.5 80,82.5 76,82.5 76,86.5 72,86.5 72,82.5 72,78.5 76,78.5 72,74.5 99.9,74.9 100,78.5 99,70.5 96,70.5 92,70.5 92,66.5 96,66.5 100,66.5 96,62.5 92,62.5 88,62.5 88,66.5 84,62.5 84,58.5 88,58.5 92,58.5 96,58.5 100,58.5 103,54.45 99,54.45 95,54.45 91,54.45 79,58.5 87,50.5 91,50.5 95,50.5 99,50.5 103,50.5 103,46.5 99,46.5 95,46.5 91,46.5 87,46.5 80,46.5 80,50.5 80,42.5 95,42.5 99,42.5 103,42.5 107,42.5 107,46.5 115,46.5 115,50.5 119,50.5 119,46.5 111,42.5 111,38.5 107,38.5 103,38.5 99,38.5 95,38.5 95,34.5 99,34.5 103,34.5 91,34.5 87,34.5 79.8,34.3 80,38.5 76.8,38.5 72,38.5 76,35.5 67.1,34.9 76,42.5 119,54.5 115,62.5 119,62.5 119,66.5 115,65.5 111,65.5 107.1,65.5 107.1,63.5 111,63.5 111,70.5 96,98.5 111.9,108.8 118.2,115.9 59,26.5 163,26.5 167,26.5 167,30.5 167,34.5 171,34.5 171,30.5 171,38.5 167,38.5 167,42.5 171,42.5 163,62.5 170.5,86.5 170.5,89.7 171.4,94.5 171.4,98.5 166,106.5 159.1,54.7 119,18.5 119,14.5 163,12.5 167,12.5 171,12.5 171.8,20.1 166.7,18 163,18.5 171,22.5 163,4.5 65.9,39.5 61.5,39.5 107,4.5 119,4.5 100,6.5 96,6.5 88,6.5 84,6.5 80,6.5 76,6.5 72,6.5 68,6.5 64,6.5 56,6.5 52,6.5 48,6.5 44,6.5 40,6.5 36,6.5 32,6.5 24,6.5 20,6.5 32,46.5 32,42.5 34,44.5 126.6,119.1 124,118.5 115.5,119.2 123.8,115 129,114.5 131,113.2 98.1,118.7 98.9,118.7 97.3,115.7 98.1,115.7 98.9,115.7 96.9,118 96.9,117.2 96.9,116.4 32,127.5 39.5,126.3 47.2,126.2 50.2,125.5 71.9,117.5 71.9,115.1 64.2,115.1 64.3,117.6 65.2,117.6 72.8,117.5 29.3,119.2 30.4,119.2 27.1,119.2 33.2,120.9 32.6,119.7 44,120.9 43.4,119.7 41.2,119.2 40.1,119.2 42.3,115.4 31.4,115.4 50.9,119.2 52,119.2 54.8,120.9 54.2,119.7 53.2,115.4 49.8,107.4 48.1,109.3 45.6,107.4 68.8,100.1 62,106.3 68.7,108.1 68.7,115.1 84.3,109.9 111.4,121.1 117.1,119.7 117.9,114.3 118.2,117.7 117.2,112.8 119.8,110.5 128.4,113.8 129.5,113.8 133.6,127.4 133.7,124.2 145.4,129.4 146.5,128.4 145.4,127.4 128.8,112.3 107.6,81 119.3,72.2 112,58.5 108.6,58.2 104.6,51.7 112.2,46.5 115,38.1 97.4,25.3 86.8,25.3 76.2,25.3 65.6,25.4 55,25.3 45.2,25.8 33.8,25.3 23.2,25.3 53.1,61.1 159.1,127 134.5,120.5 111,73.1 105.8,56.4 109.2,57 46.5,33 75,53.2 64,39.6 70.3,34.9 15.2,69.6 18.8,69.4 79.8,60.6 79.8,57.2 75.9,56.8 12.5,22.5 21.6,28.3 25.1,28 35.9,27.5 31.4,28 41,27.5 46.4,28.2 57.5,28.4 61.9,27.3 61.6,26.4 57.6,27 72.4,27.3 78.3,27.7 84.3,27.7 88.7,28.1 95.2,28.1 120.2,11.1 120.3,22.8 116.8,26.3 118.4,8 91.9,9.5 81.3,9.5 70.7,9.5 60.1,9.5 49.5,9.6 38.9,9.6 28.3,9.5 8.05,93.65 8.55,94.15 27.6,66.5 25.5,70.6 27.5,62.5 12.5,92.7 111.5,123.5 103.7,20.5 100,116.9 100,117.7 100.6,117.3 60.2,47.1 57,46.7 53.4,47.15 45.7,55 50,46.15 151.2,96 164.8,96 158,89.2 158,102.8 162.8,91.2 162.8,100.8 32.8,53.7 44.3,43.2 43.3,46.7 49.4,42.3 47.7,37.9 61.7,34.9 64.4,36.4 75.1,18.5 53.8,51.6 129.2,40.7 160.1,52.6 120.8,36.7 120.7,32.9 97,19 101,24.6 61.7,100.2 112.8,99.1 135.6,106 136.2,100.9 145.8,102.2 132.6,81.4 129.1,83.1 135.5,81.6 139.3,81.5 142.2,81.5 146.2,81.4 148.6,81.5 148.7,85 139.5,60.8 31.9,63.4 43.5,62.8 46.1,62.8 37.15,60.25 39.7,60.25 139.7,105.2 139.7,101.9 139.7,103.4 116,75.4 118.5,80.4 120.2,75.4 128.8,77.9 125,78.4 126,81.6 125.4,81.6 125.1,80.1 45.4,30.8 35.4,102.4 35.3,105.1 37.9,104.5 37.9,102.2 35.2,103.3 113.9,106.6 111.7,105.7 106.9,105.7 109.2,104.2 105.9,98.7 101.1,95.9 100.6,101 104,104.4 81.9,55.2 57.5,51 57.5,52.3 59.6,52.6 59.2,51.6 50.7,61 55.7,60.9 56.5,60.9 58.8,61 73.2,50.3 74.4,50.8 74,52.9 44.9,18.2 43.7,18.1 55.7,18.1 48.8,20.4 50.2,20.4 127.3,73.6 134.4,73.2 141.6,73.4 148.6,73.3 156.4,72.9 162.2,77.2 164.7,75.1 165.4,45.3 165.6,42 160.7,45 119.1,86.8 121.9,84.1 149.1,104.9 90.1,104.6 91.5,104.6 92.9,104.6 86.7,107.3 87.7,107.3 94.35,108.6 95.2,108.6 96.2,108.6 97.3,108.6 98.4,108.6 100.3,108.6 99.4,108.6 94.35,107.9 96.1,107.5 97.4,107.3 99,107.3 96.5,118.7 96.2,117.6 96.2,116.8 96.5,115.7 95.4,119.1 94.5,119.1 93.5,119.1 92.5,119.3 91.4,119.3 90.7,118.7 83.4,109.9 82.5,109.9 81.6,109.9 80.6,109.9 84.3,109 84.3,108.1 95.2,107.9 19.8,82.5 26.3,82.5 26.3,76 27.7,75.4 22.9,79.4 84.6,121.4 88.75,121.45 83.4,117 118.7,100.1 120.6,103.6 130.4,103.6 129.8,100.2 129.8,95.9 118.7,95.6 113.7,92.9 127.2,89.7 134.8,98.4 133.6,95.7 131,105.8 44,86.5 40,86.5 36,86.5 36,94.5 40,94.5 44,94.5 48,94.5 52,94.5 56,94.5 60,94.5 64.8,100.1 68.8,96.1 66.8,98.1 20,42.5 24,42.5 28,42.5 28,46.5 24,46.5 20,46.5 20,50.5 24,50.5 28,50.5 28,38.5 24,38.5 20,38.5 12,38.5 8,38.5 8,42.5 8,46.5 12,46.5 12,42.5 12,34.5 8,34.5 6,34.5 16,1 12,1 103,4.5 103,10.5 107,8.5 107,12.5 105.3,15.1 111,16.5 115,16.5 115,12.5 111,12.5 111,20.5 111,24.5 111,28.5 115,28.5 107,28.5 107,34.5 111,34.5 114,34.5 83,46.5 83,50.5 83,42.5 83,38.5 83,34.5 104,58.5 104,62.5 104,66.5 104,70.5 107.1,70.5 108,75.4 108,83.4 106,83.4 115,70.5 115,73.1 127,54.5 130.6,54.5 140.4,58.6 152.6,81.6 6.5,113.2 6.4,110.6 6.4,108.1 8.4,108.8 8.4,111.3 8.4,113.9 11.4,109.4 10.8,111.2 8.4,81.2 6.5,81.1 163,30.5 163,34.5 163,38.5 171,46.5 167,46.5 167,50.5 167,54.5 171,50.5 171,54.5 171,58.5 171,62.5 167,62.5 167,65.5 171,66.5 160,58.5 160,60.5 160,65.5 160,63.5 160,68.5 160.1,71.8 160.1,74.45 163,74.5 163,71.5 163,69.2 163,66.5 171,71.5 171,69.5 171,81.9 167,81.9 163,81.9 159,81.9 156,81.9 167.2,87.1 170.5,102.5 171,110.5 167,110.5 163,110.5 163.7,108.1 155,109.5 159,109.5 150,106.5 146,106.5 153,114.5 153,118.5 153,122.7 157,122.7 160,132 171,114.5 171,118.5 171,122.5 168,122.5 168,118.5 165,118.5 165,122.5 159,123.7 96,94.5 92,90.5 104.8,107.7 104.8,108.9 104.9,112.8 103,112.5 104.8,118.8 103.2,118.8 103.2,117.4 104.8,117.4 24,134 20,134 16,134 12,134 1,134 1,131 4,134 1,125 1,128 8,134 1,121 1,117 1,113 1,109 1,105 1,101 1,97 1,93 1,89 1,85 1,81 1,77 1,73 1,69 1,65 1,61 1,57 1,53 1,49 1,45 1,41 1,37 1,33 1,29 1,25 1,21 1,17 1,13 1,9 1,5 1,1 8,1 4,1 123.2,89.7 131.2,89.7 137.2,89.7 141.2,89.7 145.2,89.7 146.2,86.7 145.2,92.7 145.2,96.7 141.2,96.7 141.2,92.7 138.2,96.7 105.9,102.7 109.9,102.7 102.9,98.7 109.7,92.9 106.7,92.9 108.7,94.9 112.7,94.9 114.8,99.1 114.8,101.1 57,104.5 57,101.5 53,101.5 48,101.5 44,101.5 44,103.5 48,103.5 48,106.5 53,104.5 24,130.5 20,130.5 16,130.5 16,126.5 16,122.5 20,122.5 20,118.5 16,118.5 16,114.5 20,114.5 12,114.5 12,118.5 5,117 5,121 9,121 4,113 4,109 4,105 4,101 4,97 4,93 4,89 4,85 4,81 5,77 5,73 5,69 5,65 5,61 5,57 5,53 5,49 5,45 5,41 5,37 5,33 5,29 5,25 5,21 5,17 5,13 9,13 16,5 13,5 13,9 11,11 12,50.5 12,53.5 12,56.5 16,56.5 16,53.5 20,53.5 20,55.5 24,55.5 24,53.5 28,53.5 28,55.5 33,55.5 37,55.5 37,52.5 35,52.5 16,30.5 20,30.5 16,32.5 20,35.5 24,35.5 28,35.5 32,35.5 36,34.5 39,33.5 24,30.5 28,30.5 32,30.5 36,30.5 39,30.5 50.4,28.2 50.4,30.2 53.4,30.2 53.4,28.2 13,26.5 13,29.5 13,18.5 11,16.5 11,19.5 13,12.5 13,15.5 17,19.5 17,15.5 17,11.5 17,8.5 11.1,14 20,11.5 24,11.5 28,11.5 24,13.5 20,13.5 32,11.5 36,11.5 41,11.5 44,11.5 48,11.5 52,11.5 56,11.5 60,11.5 61.4,11.1 64.4,11.1 68.4,11.1 71.6,10.7 75.6,10.7 79.6,10.7 84,10.1 89,10.1 20,3 28,3 32,3 36,3 40,3 48,3 52,3 60,3 68,3 72,3 80,3 84,3 92,3 100,3 104,3 104,1 104,8.5 104,11.5 108,24.5 108.5,20.5 20,63.5 20,59.5 24,59.5 26,59.5 17.2,61 8,73 8,76 12,76 12,73 12,69 16,72 12,65 14,66 10.8,63.8 12.6,61.3 10.6,61.3 10.6,58.9 14.6,58.9 31,94.5 31,90.5 31,86.5 31,82.5 31,78.5 31,75.5 31,72.5 18,83.5 13,83.5 13,87.5 13,90.5 16,90.5 16,87.5 16,83.5 18,87.5 18,90.5 18,92.5 16,93.5 15,93.5 16,94.5 15,94.5 11.9,96.1 9,97 8,101 12,101 16,101 19,101 16,98 12,98 8,98 8,105 12,105 12,107 15,105 20,108.5 20,106.5 23,104.5 23,108.5 23,112.5 26,112.5 27,100.5 29.5,103.3 28,104.8 28,126.5 28,122.5 32,122.5 36,122.5 40,122.5 43,122.5 45,122.5 48,122.5 52,122.5 25,124.5 20,94 23,96 18,73 18,77 15,77 11,79 15,79 21,75 59.1,53.5 56.2,53.5 123,7 127,7 131,7 135,7 139,7 143,7 147,7 151,7 155,7 159,7 159,11 154.6,11 147,11 142.8,11 139.1,10.9 135,11 132.1,11 127,11 127,15 123,15 131.3,15 139,15 143,15 147,15 151,15 155,15 159,15 127,20 123,20 131,20 139,20 143,20 147,20 151,20 155,20 158,20 127,24 132,24 139,24 142.9,24 147,24 155,24 159.3,24 127,28 122.3,27.7 132.6,28 138.8,28 135.9,27.7 143,28 147,28 155,28 158.4,28 149.5,27.7 150,30.9 155,31 159,30.9 127,31.4 125,31.4 132.2,31.4 139,31.4 143,31.4 147,31.4 123,34 127,34 132,34 136,34 139,34 143,34 147,34 151,34 155,34 159,34 159,38 155,38 147,38 143,38 139,38 132.1,37.8 127,38 127.3,42.5 122.3,41.3 123,44 127,45 132.8,42.7 139,42 136,42 136,44 139,45 143,42 143,45 147,42 147,45 147,47 155.6,42 152,42 150,42 150,44 152,45 155,45 159,41.1 115,53.5 127,58.5 123,58.5 127,48.5 123,48.5 132,48.5 136,48.5 140,48.5 144,48.5 148,48.5 152,48.5 155.6,51.9 156,56.5 152,56.5 148,56.5 148,52.5 152,54.5 144.2,52.6 140,52.5 139.6,56.5 144,56.5 136,56.5 123,62.5 127,62.5 127,66.5 123,66.5 132,66.5 132,62.5 135,62.5 139,62.5 140,66.5 136,66.5 143,66.5 144,62.5 143,59.5 148,62.5 148,66.5 151,66.5 151,62.5 153,66.5 153,62.5 156,62.5 156,66.5 156,70.5 152.9,70.4 153,58.5 151,58.5 155,58.5 160.3,77.8 164.2,76.6 156,48.5 156,46.5 152,46.5 78.5,114.5 78.5,110.5 78.5,108.5 82.5,108.5 82.5,105.5 86.5,105.5 86.5,102.5 84.5,103.5 90.5,102.5 94.5,102.5 98.5,102.5 98.5,105.5 101.5,105.5 102.5,108.5 92.75,121.45 96.75,121.45 100.75,121.45 96.75,123.45 98.75,127.45 98.75,125.45 108,119.5 106,120.5 120.5,119.7 126.8,127.6 117.2,108.7 123.4,108.4 129,109.4 104.2,127.4 111.8,117.4 108.9,116.2 80,102.5 80,104.5 78.2,106.3 50.8,58 55,60.2 120.9,29.8 100.5,31.7 114.2,31.7 107,31.7 111,31.7 103.4,79.8 103.4,75.3 100.3,62.5
  pour Top (rank 3): 0.5,0.5 174.5,0.5 174.5,134.5 0.5,134.5
  pour Bottom (rank 3): 0.5,0.5 174.5,0.5 174.5,134.5 0.5,134.5
  pour Bottom (isolate 0.3, no thermals): 158,103.9 arc-90 165.9,96 arc-90 158,88.1 arc-90 150.1,96 arc-90
  pour Top (isolate 0.3, no thermals): 158,103.9 arc-90 165.9,96 arc-90 158,88.1 arc-90 150.1,96 arc-90
N$1
  Top 0.2: R1.1 95.24,24.2 T1.3
N$2
  Top 0.2: IC1.34 38.6,45.7 38.2,45.3 38.2,44 37.56,43.36 C8.1 35.08,43.36 Q1.1
N$3
  Top 0.2: R4.2 84.44,27 LD1.K
N$4
  Top 0.5: C17.2 93.06,117.2 D3.C 93.41,116.14 IC4.1 93.41,114.6 95.35,114.6 L4.1
  pour Top (no thermals): 96.2,109.2 94.5,109.2 94.5,113.7 93,113.7 93,118.2 95.5,118.2 95.5,115.7 96.2,115
N$5
  Top 0.2: 92.2,108.97 IC4.7
  Top 0.3: C24.1 92.14,107.13 IC4.7
N$6
  Top 0.2: IC1.33 37.54,46.2 C9.1 35.25,46.06 Q1.2
N$7
  Top 0.3: R58.2 R139.1
N$8
  Top 0.2: R1.2 95.04,27 LD0.K
N$9
  Top 0.3: 54.72,52.31 C2.1 | C2.1 C1.1 54.74,49.81 IC1.100 54.1,49.7 53.9,49.5 53.9,48.9 54.1,48.7 IC1.98 | L1.2 55.1,54.92 55.1,52.66 C2.1
N$10
  Top 0.2: R7.2 73.84,27 LD2.K
N$11
  Top 0.5: D1.A 107.55,114.58 L2.2
N$16
  Top 0.2: R9.2 63.24,27 LD3.K
N$17
  Top 0.2: LD4.K 52.64,27 R13.2
N$18
  Top 0.2: LD5.K 42.04,27 R16.2
N$19
  Top 0.2: R19.2 31.44,27 LD6.K
N$20
  Top 0.2: R22.2 20.84,27 LD7.K
N$21
  Top 0.2: R4.1 84.64,24.2 T2.3
N$22
  Top 0.2: R7.1 74.04,24.2 T3.3
N$23
  Top 0.2: T4.3 63.44,24.2 R9.1
N$24
  Top 0.2: R13.1 52.84,24.2 T5.3
N$25
  Top 0.2: R16.1 42.24,24.2 T6.3
N$26
  Top 0.2: T7.3 31.64,24.2 R19.1
N$27
  Top 0.2: T8.3 21.04,24.2 R22.1
N$28
  Top 0.2: 12,92 12,84.4 12.4,84 12.4,83.2 12.9,82.7 18.7,82.7 31.1,70.3 31.1,62.8 31.3,62.6 35.1,62.6 35.6,62.1 54.28,62.1 R138.2 | 12,92 10.3,93.7 9.1,93.7 7.95,92.55 CN10.3 | 12,92 15.05,92 P1.2